# EAGLE design FlightComputer_RevA (EAGLE 9.0.1)
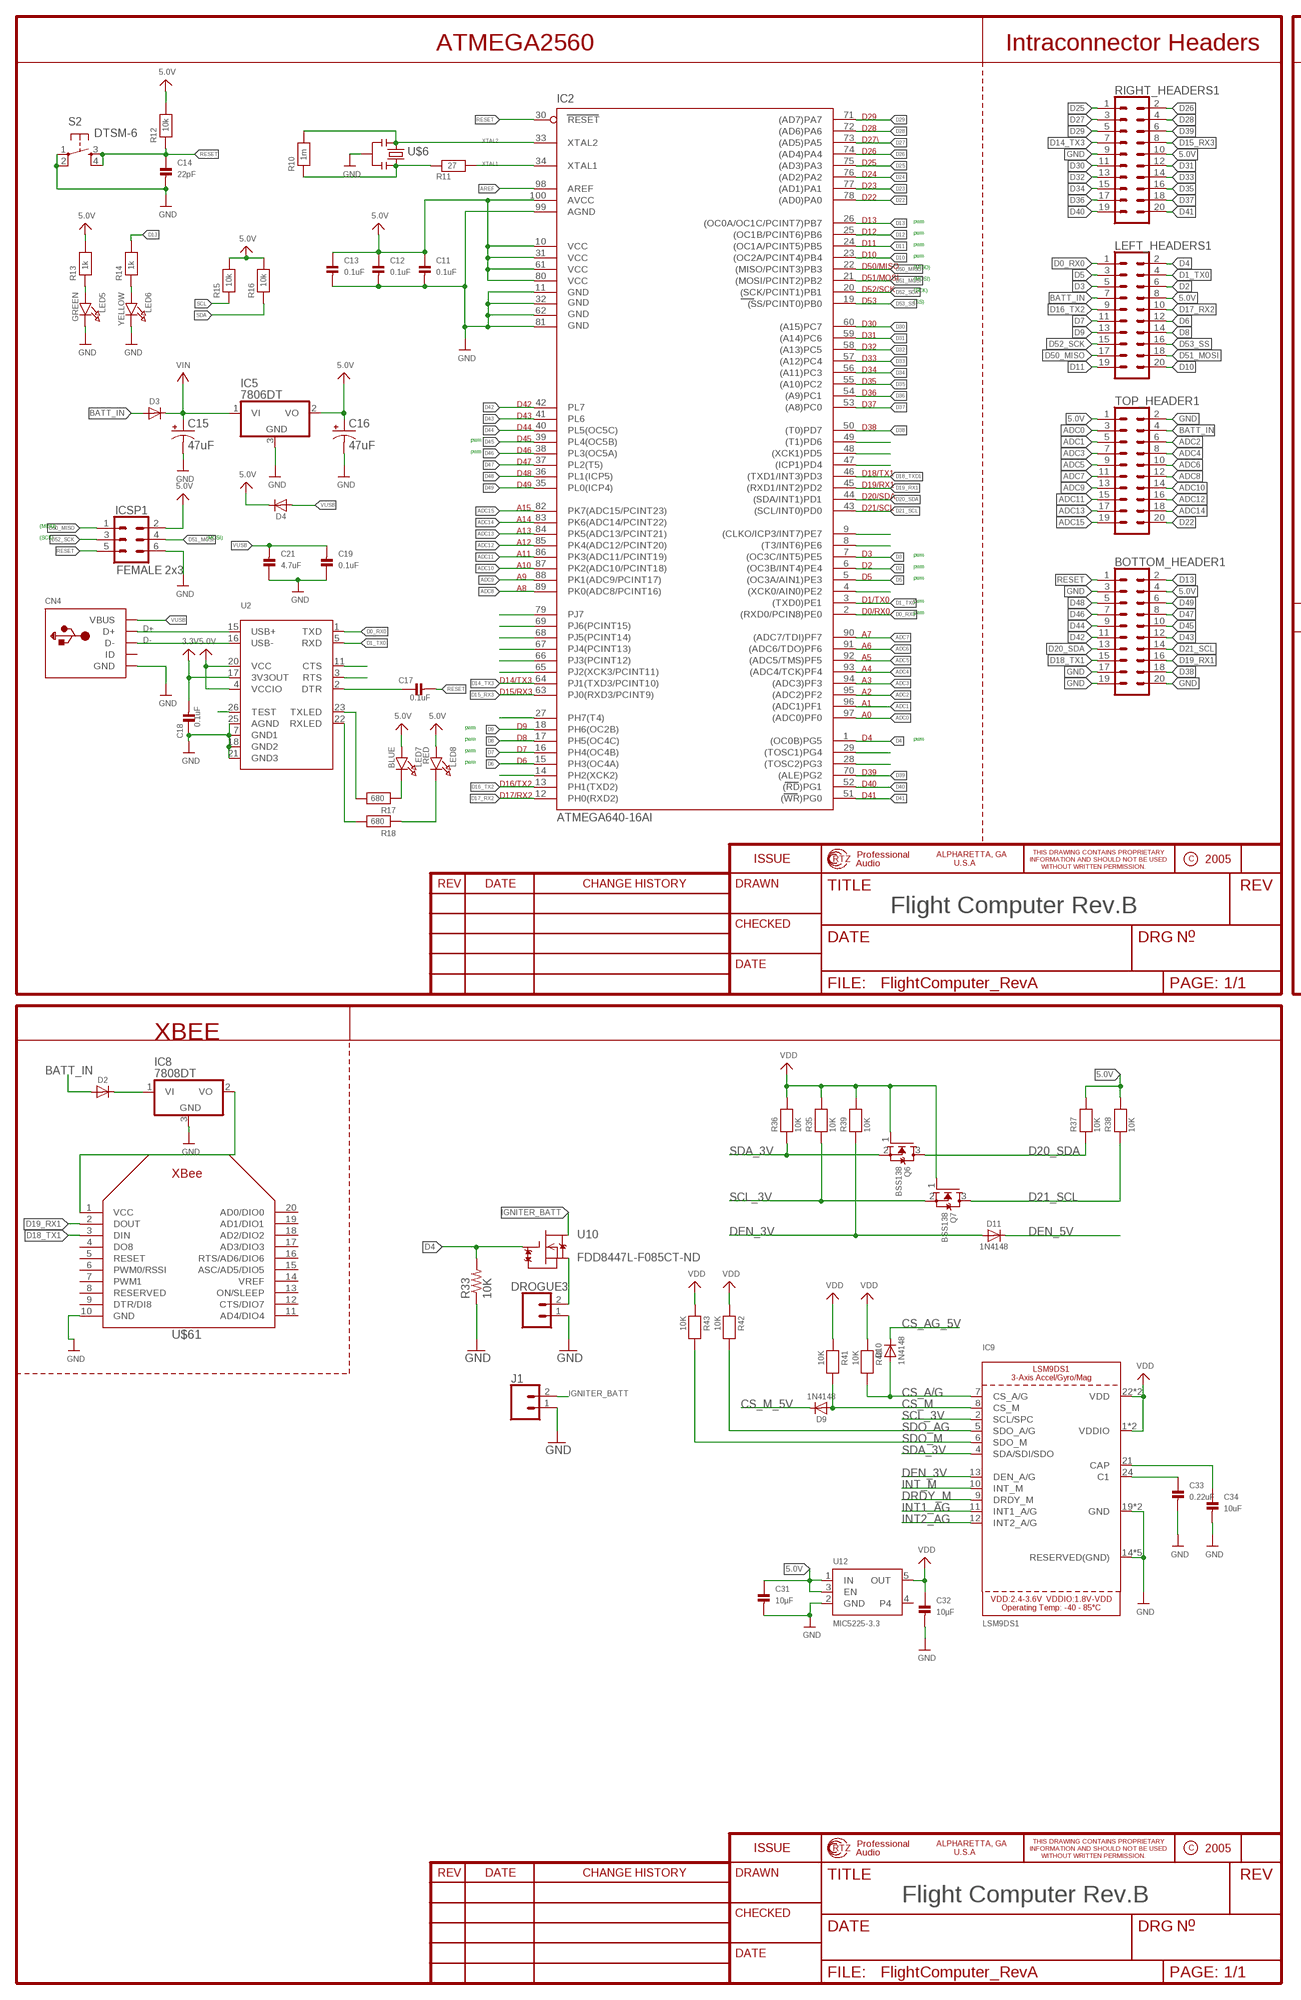
[diagram p0: schematic, sheet 1, part 1 of 2]
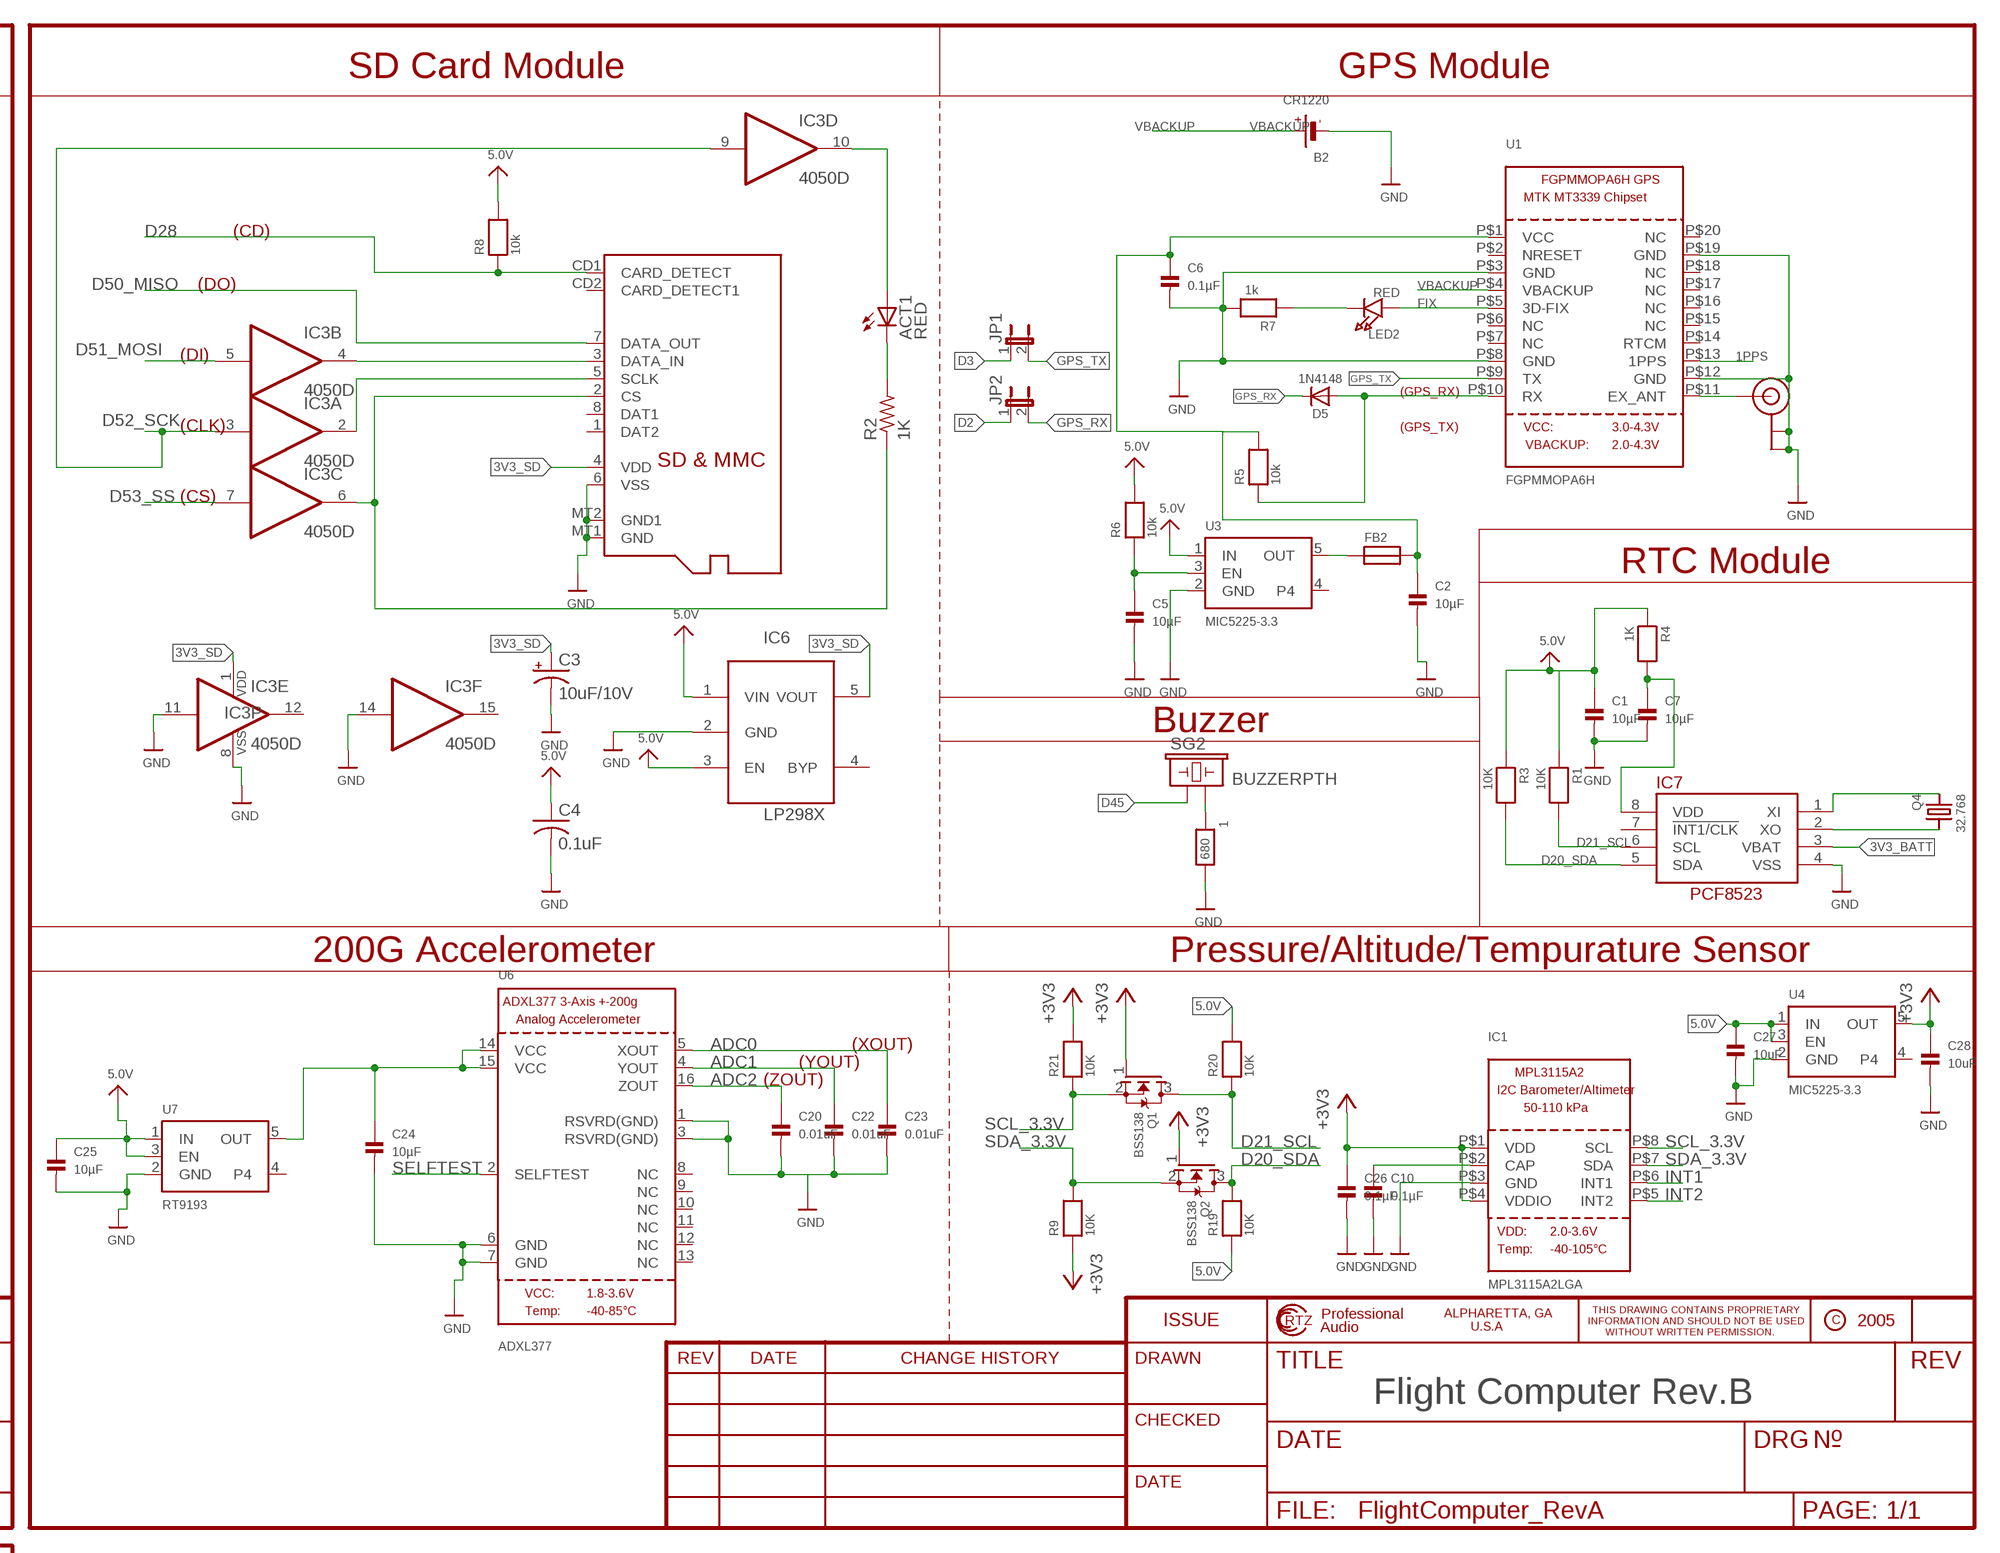
[diagram p1: schematic, sheet 1, part 2 of 2]

## Parts
1  680  RESISTOR0603  [0603]
ACT1  RED  LEDCHIP-LED0805  [CHIP-LED0805]
B2  CR1220  BATTERYCR1220_SMT  [CR1220]
BOTTOM_HEADER1  CONN_10X2  [2X10]
C1  10µF  CAP_CERAMIC0603  [0603]
C2  10µF  CAP_CERAMIC0603  [0603]
C3  10uF/10V  CPOL-USA/3216-18R  [A/3216-18R]
C4  0.1uF  C-USC0805K  [C0805K]
C5  10µF  CAP_CERAMIC0603  [0603]
C6  0.1µF  CAP_CERAMIC0603  [0603]
C7  10µF  CAP_CERAMIC0603  [0603]
C10  0.1µF  CAP_CERAMIC0603  [0603]
C11  0.1uF  CAP_CERAMIC0805  [0805]
C12  0.1uF  CAP_CERAMIC0805  [0805]
C13  0.1uF  CAP_CERAMIC0805  [0805]
C14  22pF  CAP_CERAMIC0805  [0805]
C15  47uF  CPOL-USD  [PANASONIC_D]
C16  47uF  CPOL-USD  [PANASONIC_D]
C17  0.1uF  CAP_CERAMIC0805  [0805]
C18  0.1uF  CAP_CERAMIC0805  [0805]
C19  0.1uF  CAP_CERAMIC0805  [0805]
C20  0.01uF  CAP_CERAMIC0603  [0603]
C21  4.7uF  CAP_CERAMIC0805  [0805]
C22  0.01uF  CAP_CERAMIC0603  [0603]
C23  0.01uF  CAP_CERAMIC0603  [0603]
C24  10µF  CAP_CERAMIC0603  [0603]
C25  10µF  CAP_CERAMIC0603  [0603]
C26  0.1µF  CAP_CERAMIC0603  [0603]
C27  10uF  CAP_CERAMIC0603  [0603]
C28  10uF  CAP_CERAMIC0603  [0603]
C31  10µF  CAP_CERAMIC0603  [0603]
C32  10µF  CAP_CERAMIC0603  [0603]
C33  0.22uF  CAP_CERAMIC0603  [0603]
C34  10uF  CAP_CERAMIC0603  [0603]
CN4  USBMINIB  [USB-MINIB]
D2  DIODESOD-123  [SOD-123]
D3  DIODESOD-123  [SOD-123]
D4  DIODESOD-123  [SOD-123]
D5  1N4148  DIODESOD-323  [SOD-323]
D9  1N4148  DIODESOD-323  [SOD-323]
D10  1N4148  DIODESOD-323  [SOD-323]
D11  1N4148  DIODESOD-323  [SOD-323]
DROGUE3  CONN_023.5MM  [SCREWTERMINAL-3.5MM-2]
FB2  FERRITE  [0603]
IC1  MPL3115A2LGA  [LGA8]
IC2  ATMEGA640-16AI  [TQFP100]
IC3  4050D  [SO16]
IC5  7806DT  [TO252]
IC6  LP298XS  [SOT23-5L]
IC7  RTC_PCF8523T  [SOIC8_150MIL]
IC8  7808DT  [TO252]
IC9  LSM9DS1  [LGA24_3.5X3.1MM]
ICSP1  FEMALE 2x3  CONN_03X2FEMALE  [2X3]
J1  CONN_02  [1X02]
JP1  JUMPER-2SMD-NO-NS  [SJ_2S-NO-NS]
JP2  JUMPER-2SMD-NO-NS  [SJ_2S-NO-NS]
LED2  RED  LED0805  [CHIPLED_0805]
LED5  GREEN  LED0805  [CHIPLED_0805]
LED6  YELLOW  LED0805  [CHIPLED_0805]
LED7  BLUE  LED0805  [CHIPLED_0805]
LED8  RED  LED0805  [CHIPLED_0805]
LEFT_HEADERS1  CONN_10X2  [2X10]
Q1  BSS138  MOSFET-NWIDE  [SOT23-WIDE]
Q2  BSS138  MOSFET-NWIDE  [SOT23-WIDE]
Q4  32.768  CRYSTAL8.0X3.8  [CRYSTAL_8X3.8]
Q6  BSS138  MOSFET-NWIDE  [SOT23-WIDE]
Q7  BSS138  MOSFET-NWIDE  [SOT23-WIDE]
R1  10K  RESISTOR0603  [0603]
R2  1K  R-US_R0805  [R0805]
R3  10K  RESISTOR0603  [0603]
R4  1K  RESISTOR0603  [0603]
R5  10k  RESISTOR0603  [0603]
R6  10k  RESISTOR0603  [0603]
R7  1k  RESISTOR0603  [0603]
R8  10k  RESISTOR0603  [0603]
R9  10K  RESISTOR0603  [0603]
R10  1m  RESISTOR0805  [0805]
R11  27  RESISTOR0805  [0805]
R12  10k  RESISTOR0805  [0805]
R13  1k  RESISTOR0805  [0805]
R14  1k  RESISTOR0805  [0805]
R15  10k  RESISTOR0805  [0805]
R16  10k  RESISTOR0805  [0805]
R17  680  RESISTOR0805  [0805]
R18  680  RESISTOR0805  [0805]
R19  10K  RESISTOR0603  [0603]
R20  10K  RESISTOR0603  [0603]
R21  10K  RESISTOR0603  [0603]
R33  10K  R-US_R0805  [R0805]
R35  10K  RESISTOR0603  [0603]
R36  10K  RESISTOR0603  [0603]
R37  10K  RESISTOR0603  [0603]
R38  10K  RESISTOR0603  [0603]
R39  10K  RESISTOR0603  [0603]
R40  10K  RESISTOR0603  [0603]
R41  10K  RESISTOR0603  [0603]
R42  10K  RESISTOR0603  [0603]
R43  10K  RESISTOR0603  [0603]
RIGHT_HEADERS1  CONN_10X2  [2X10]
S2  DTSM-6  [DTSM-6]
SG2  BUZZERPTH  [BUZZER-12MM]
TOP_HEADER1  CONN_10X2  [2X10]
U1  FGPMMOPA6H  GPS_FGPMMOPA6H  [FGPMMOPA6H]
U2  FT232RLSSOP28  [SSOP28DB]
U3  MIC5225-3.3  VREG_SOT23-5  [SOT23-5]
U4  MIC5225-3.3  VREG_SOT23-5  [SOT23-5]
U6  ADXL377  ACCEL_ADXL377  [LFCSP16_LQ]
U7  RT9193  VREG_SOT23-5  [SOT23-5]
U10  FDD8447L-F085CT-ND  TSM4ND50  [TO252]
U12  MIC5225-3.3  VREG_SOT23-5  [SOT23-5]
U$1  U.FL  [U.FL]
U$6  RESONATORSMD  [RESONATOR-SMD]
U$61  XBEE  [XBEE]
X2  MICROSD  [MICROSD]

## Nets
1PPS: U1.P$13(1PPS)
3.3V [16mil]: C18.2 U2.17(3V3OUT)
3V3_BATT: IC7.3(VBAT)
3V3_SD: C3.+ IC3.1(P:VDD) IC6.5(VOUT) X2.4(VDD)
5.0V: BOTTOM_HEADER1.4 C1.1 C4.1 C11.1 C12.1 C13.1 C16.+ C25.1 C27.1 C31.1 D4.C IC2.10(VCC) IC2.31(VCC1) IC2.61(VCC2) IC2.80(VCC3) IC2.100(AVCC) IC5.2(VO) IC6.1(VIN) IC6.3(EN) ICSP1.2 LED7.A LED8.A LEFT_HEADERS1.8 R1.1 R3.1 R4.1 R6.2 R8.2 R12.2 R13.2 R15.2 R16.2 R19.1 R20.2 R37.2 R38.2 RIGHT_HEADERS1.10 TOP_HEADER1.1 U2.4(VCCIO) U2.20(VCC) U3.1(IN) U4.1(IN) U4.3(EN) U7.1(IN) U7.3(EN) U12.1(IN) U12.3(EN)
+3V3: C26.1 C28.1 IC1.P$1(VDD) IC1.P$4(VDDIO) Q1.1(G) Q2.1(G) R9.1 R21.2 U4.5(OUT)
ADC0: C23.1 IC2.97((ADC0)PF0) TOP_HEADER1.3 U6.5(XOUT)
ADC1: C22.1 IC2.96((ADC1)PF1) TOP_HEADER1.5 U6.4(YOUT)
ADC2: C20.1 IC2.95((ADC2)PF2) TOP_HEADER1.6 U6.16(ZOUT)
ADC3: IC2.94((ADC3)PF3) TOP_HEADER1.7
ADC4: IC2.93((ADC4/TCK)PF4) TOP_HEADER1.8
ADC5: IC2.92((ADC5/TMS)PF5) TOP_HEADER1.9
ADC6: IC2.91((ADC6/TDO)PF6) TOP_HEADER1.10
ADC7: IC2.90((ADC7/TDI)PF7) TOP_HEADER1.11
ADC8: IC2.89(PK0(ADC8/PCINT16)) TOP_HEADER1.12
ADC9: IC2.88(PK1(ADC9/PCINT17)) TOP_HEADER1.13
ADC10: IC2.87(PK2(ADC10/PCINT18)) TOP_HEADER1.14
ADC11: IC2.86(PK3(ADC11/PCINT19)) TOP_HEADER1.15
ADC12: IC2.85(PK4(ADC12/PCINT20)) TOP_HEADER1.16
ADC13: IC2.84(PK5(ADC13/PCINT21)) TOP_HEADER1.17
ADC14: IC2.83(PK6(ADC14/PCINT22)) TOP_HEADER1.18
ADC15: IC2.82(PK7(ADC15/PCINT23)) TOP_HEADER1.19
AREF: IC2.98(AREF)
BATT_IN: D2.A D3.A LEFT_HEADERS1.7 TOP_HEADER1.4
C1: C33.1 IC9.24(C1)
CAP1: C10.1 IC1.P$2(CAP)
CAP3: C34.1 IC9.21(CAP)
CS_A/G: D10.A IC9.7(CS_A/G) R40.2
CS_AG_5V: D10.C
CS_M: D9.A IC9.8(CS_M) R41.2
CS_M_5V: D9.C
D0_RX0: IC2.2((RXD0/PCIN8)PE0) LEFT_HEADERS1.1 U2.1(TXD)
D1_TX0: IC2.3((TXD0)PE1) LEFT_HEADERS1.4 U2.5(RXD)
D2: IC2.6((OC3B/INT4)PE4) JP2.1 LEFT_HEADERS1.6
D3: IC2.7((OC3C/INT5)PE5) JP1.1 LEFT_HEADERS1.5
D4: IC2.1((OC0B)PG5) LEFT_HEADERS1.2 R33.2 U10.G
D5: IC2.5((OC3A/AIN1)PE3) LEFT_HEADERS1.3
D6: IC2.15(PH3(OC4A)) LEFT_HEADERS1.12
D7: IC2.16(PH4(OC4B)) LEFT_HEADERS1.11
D8: IC2.17(PH5(OC4C)) LEFT_HEADERS1.14
D9: IC2.18(PH6(OC2B)) LEFT_HEADERS1.13
D10: IC2.23((OC2A/PCINT4)PB4) LEFT_HEADERS1.20
D11: IC2.24((OC1A/PCINT5)PB5) LEFT_HEADERS1.19
D12: IC2.25((OC1B/PCINT6)PB6)
D13: BOTTOM_HEADER1.2 IC2.26((OC0A/OC1C/PCINT7)PB7) R14.2
D14_TX3: IC2.64(PJ1(TXD3/PCINT10)) RIGHT_HEADERS1.7
D15_RX3: IC2.63(PJ0(RXD3/PCINT9)) RIGHT_HEADERS1.8
D16_TX2: IC2.13(PH1(TXD2)) LEFT_HEADERS1.9
D17_RX2: IC2.12(PH0(RXD2)) LEFT_HEADERS1.10
D18_TX1: BOTTOM_HEADER1.15 U$61.3(DIN)
D18_TXD1: IC2.46((TXD1/INT3)PD3)
D19_RX1: BOTTOM_HEADER1.16 IC2.45((RXD1/INT2)PD2) U$61.2(DOUT)
D20_SDA: BOTTOM_HEADER1.13 IC2.44((SDA/INT1)PD1) IC7.5(SDA) Q2.3(D) Q6.3(D) R3.2 R19.2 R37.1
D21_SCL: BOTTOM_HEADER1.14 IC2.43((SCL/INT0)PD0) IC7.6(SCL) Q1.3(D) Q7.3(D) R1.2 R20.1 R38.1
D22: IC2.78((AD0)PA0) TOP_HEADER1.20
D23: IC2.77((AD1)PA1)
D24: IC2.76((AD2)PA2)
D25: IC2.75((AD3)PA3) RIGHT_HEADERS1.1
D26: IC2.74((AD4)PA4) RIGHT_HEADERS1.2
D27: IC2.73((AD5)PA5) RIGHT_HEADERS1.3
D28: IC2.72((AD6)PA6) R8.1 RIGHT_HEADERS1.4 X2.CD1(CARD_DETECT)
D29: IC2.71((AD7)PA7) RIGHT_HEADERS1.5
D30: IC2.60((A15)PC7) RIGHT_HEADERS1.11
D31: IC2.59((A14)PC6) RIGHT_HEADERS1.12
D32: IC2.58((A13)PC5) RIGHT_HEADERS1.13
D33: IC2.57((A12)PC4) RIGHT_HEADERS1.14
D34: IC2.56((A11)PC3) RIGHT_HEADERS1.15
D35: IC2.55((A10)PC2) RIGHT_HEADERS1.16
D36: IC2.54((A9)PC1) RIGHT_HEADERS1.17
D37: IC2.53((A8)PC0) RIGHT_HEADERS1.18
D38: BOTTOM_HEADER1.18 IC2.50((T0)PD7)
D39: IC2.70((ALE)PG2) RIGHT_HEADERS1.6
D40: IC2.52((RD)PG1) RIGHT_HEADERS1.19
D41: IC2.51((WR)PG0) RIGHT_HEADERS1.20
D42: BOTTOM_HEADER1.11 IC2.42(PL7)
D43: BOTTOM_HEADER1.12 IC2.41(PL6)
D44: BOTTOM_HEADER1.9 IC2.40(PL5(OC5C))
D45: BOTTOM_HEADER1.10 IC2.39(PL4(OC5B)) SG2.+
D46: BOTTOM_HEADER1.7 IC2.38(PL3(OC5A))
D47: BOTTOM_HEADER1.8 IC2.37(PL2(T5))
D48: BOTTOM_HEADER1.5 IC2.36(PL1(ICP5))
D49: BOTTOM_HEADER1.6 IC2.35(PL0(ICP4))
D50_MISO: IC2.22((MISO/PCINT3)PB3) ICSP1.1 LEFT_HEADERS1.17 X2.7(DATA_OUT)
D51_MOSI: IC2.21((MOSI/PCINT2)PB2) IC3.5(B:I) ICSP1.4 LEFT_HEADERS1.18
D52_SCK: IC2.20((SCK/PCINT1)PB1) IC3.3(A:I) IC3.9(D:I) ICSP1.3 LEFT_HEADERS1.15
D53_SS: IC2.19((SS/PCINT0)PB0) IC3.7(C:I) LEFT_HEADERS1.16
D+: CN4.D+ U2.15(USB+)
D-: CN4.D- U2.16(USB-)
DEN_3V: D11.A IC9.13(DEN_A/G) R39.1
DEN_5V: D11.C
DRDY_M: IC9.9(DRDY_M)
FIX: LED2.A U1.P$5(3D-FIX)
GND: 1.2 B2.- BOTTOM_HEADER1.3 BOTTOM_HEADER1.17 BOTTOM_HEADER1.19 BOTTOM_HEADER1.20 C1.2 C2.2 C3.- C4.2 C5.2 C6.2 C7.2 C10.2 C11.2 C12.2 C13.2 C14.2 C15.- C16.- C18.1 C19.1 C20.2 C21.1 C22.2 C23.2 C24.2 C25.2 C26.2 C27.2 C28.2 C31.2 C32.2 C33.2 C34.2 CN4.GND DROGUE3.1 IC1.P$3(GND) IC2.11(GND) IC2.32(GND1) IC2.62(GND2) IC2.81(GND3) IC2.99(AGND) IC3.8(P:VSS) IC3.11(E:I) IC3.14(F:I) IC5.3(GND) IC6.2(GND) IC7.4(VSS) IC8.3(GND) IC9.14(RESERVED(GND)) IC9.15(RESERVED(GND)) IC9.16(RESERVED(GND)) IC9.17(RESERVED(GND)) IC9.18(RESERVED(GND)) IC9.19(GND) IC9.20(GND) ICSP1.6 J1.1 LED5.C LED6.C R7.2 R33.1 RIGHT_HEADERS1.9 S2.1 S2.2 TOP_HEADER1.2 U1.P$3(GND) U1.P$8(GND) U1.P$12(GND) U1.P$19(GND) U2.7(GND1) U2.18(GND2) U2.21(GND3) U2.25(AGND) U3.2(GND) U4.2(GND) U6.1(RSVRD(GND)) U6.3(RSVRD(GND)) U6.6(GND) U6.7(GND) U7.2(GND) U12.2(GND) U$1.P$1(GND) U$1.P$2(GND) U$6.2 U$61.10(GND) X2.6(VSS) X2.MT1(GND) X2.MT2(GND1)
GPS_RX: D5.C JP2.2
GPS_TX: JP1.2 U1.P$9(TX)
IGNITER_BATT: J1.2 U10.D
INT1: IC1.P$6(INT1)
INT1_AG: IC9.11(INT1_A/G)
INT2: IC1.P$5(INT2)
INT2_AG: IC9.12(INT2_A/G)
INT_M: IC9.10(INT_M)
N$2: IC7.1(XI) Q4.P$1
N$3: IC7.2(XO) Q4.P$4
N$6: ACT1.A IC3.10(D:O)
N$7: IC3.2(A:O) X2.5(SCLK)
N$8: IC3.6(C:O) R2.1 X2.2(CS)
N$9: ACT1.C R2.2
N$10: IC3.4(B:O) X2.3(DATA_IN)
N$11: C7.1 IC7.8(VDD) R4.2
N$12: U1.P$11(EX_ANT) U$1.P$3(SIGNAL)
N$13: D5.A R5.1 U1.P$10(RX)
N$14: C2.1 C6.1 FB2.2 R5.2 U1.P$1(VCC)
N$15: R10.1 R11.2 U$6.3
N$16: IC2.65(PJ2(XCK3/PCINT11))
N$17: IC2.66(PJ3(PCINT12))
N$18: C5.1 R6.1 U3.3(EN)
N$19: LED2.C R7.1
N$22: D2.C IC8.1(VI)
N$23: 1.1 SG2.-
N$27: IC2.67(PJ4(PCINT13))
N$32: IC2.68(PJ5(PCINT14))
N$33: IC2.69(PJ6(PCINT15))
N$34: IC2.79(PJ7)
N$35: IC2.27(PH7(T4))
N$36: C24.1 IC2.14(PH2(XCK2)) U6.14(VCC) U6.15(VCC) U7.5(OUT)
N$37: IC2.49((T1)PD6)
N$38: IC2.48((XCK1)PD5)
N$39: IC2.47((ICP1)PD4)
N$40: IC2.9((CLKO/ICP3/INT7)PE7)
N$41: IC2.8((T3/INT6)PE6)
N$42: IC2.4((XCK0/AIN0)PE2)
N$43: IC2.29((TOSC1)PG4)
N$44: IC2.28((TOSC2)PG3)
N$45: LED5.A R13.1
N$46: LED6.A R14.1
N$47: LED8.C R18.1
N$48: LED7.C R17.1
N$49: U2.11(CTS)
N$50: U2.3(RTS)
N$51: C17.1 U2.2(DTR)
N$52: R18.2 U2.22(RXLED)
N$53: R17.2 U2.23(TXLED)
N$54: U2.26(TEST)
OUT: FB2.1 U3.5(OUT)
RESET: BOTTOM_HEADER1.1 C14.1 C17.2 IC2.30(RESET) ICSP1.5 R12.1 S2.3 S2.4
SCL: R15.1
SCL_3.3V: IC1.P$8(SCL) Q1.2(S) R21.1
SCL_3V: IC9.2(SCL/SPC) Q7.2(S) R35.1
SDA: R16.1
SDA_3.3V: IC1.P$7(SDA) Q2.2(S) R9.2
SDA_3V: IC9.4(SDA/SDI/SDO) Q6.2(S) R36.1
SDO_AG: IC9.5(SDO_A/G) R42.2
SDO_M: IC9.6(SDO_M) R43.2
SELFTEST: U6.2(SELFTEST)
SOURCE2: DROGUE3.2 U10.S
VBACKUP: B2.+$1(+) B2.+$2(+) U1.P$4(VBACKUP)
VCC: IC8.2(VO) U$61.1(VCC)
VDD: C32.1 IC9.1(VDDIO) IC9.3(VDDIO) IC9.22(VDD) IC9.23(VDD) Q6.1(G) Q7.1(G) R35.2 R36.2 R39.2 R40.1 R41.1 R42.1 R43.1 U12.5(OUT)
VIN [24mil]: C15.+ D3.C IC5.1(VI)
VUSB [16mil]: C19.2 C21.2 CN4.VBUS D4.A
XTAL1: IC2.34(XTAL1) R11.1
XTAL2: IC2.33(XTAL2) R10.2 U$6.1
Unconnected: CN4.ID IC3.12(E:O) IC3.15(F:O) IC6.4(BYP) IC7.7(!INT1/CLK) U1.P$2(NRESET) U1.P$6(NC) U1.P$7(NC) U1.P$14(RTCM) U1.P$15(NC) U1.P$16(NC) U1.P$17(NC) U1.P$18(NC) U1.P$20(NC) U3.4 U4.4 U6.8(NC) U6.9(NC) U6.10(NC) U6.11(NC) U6.12(NC) U6.13(NC) U7.4 U12.4 U$61.4(DO8) U$61.5(RESET) U$61.6(PWM0/RSSI) U$61.7(PWM1) U$61.8(RESERVED) U$61.9(DTR/DI8) U$61.11(AD4/DIO4) U$61.12(CTS/DIO7) U$61.13(ON/SLEEP) U$61.14(VREF) U$61.15(ASC/AD5/DIO5) U$61.16(RTS/AD6/DIO6) U$61.17(AD3/DIO3) U$61.18(AD2/DIO2) U$61.19(AD1/DIO1) U$61.20(AD0/DIO0) X2.1(DAT2) X2.8(DAT1) X2.CD2(CARD_DETECT1)

## Notes on the sheet
- ATMEGA2560 | Intraconnector Headers | SD Card Module | GPS Module
- D29
- D28
- D27\
- D26 | (CD)
- D25
- D24
- D23 | (DO)
- D22
- D13 | pwm
- D12 | pwm | (DI)
- D11 | pwm
- D10 | pwm | (GPS_RX)
- D50/MISO | (MISO)
- D51/MOSI | (MOSI) | (CLK) | (GPS_TX)
- D52/SCK | (SCK)
- D53 | (SS)
- D30 | (CS)
- D31
- D32
- D33
- D34 | RTC Module
- D35
- D36
- D42 | D37
- D43
- D44 | D38
- pwm | D45
- pwm | D46
- D47
- D48 | D18/TX1 | Buzzer
- D49 | D19/RX1
- D20/SDA
- A15 | D21/SCL
- A14
- (MISO)
- A13
- (SCK) | (MOSI)
- A12
- A11 | D3 | pwm
- A10 | D2 | pwm
- A9 | D5 | pwm
- A8
- D1/TX0 | pwm
- D0/RX0 | pwm
- 200G Accelerometer | Pressure/Altitude/Tempurature Sensor
- A7
- A6
- A5
- A4
- D14/TX3 | A3 | (XOUT)
- D15/RX3 | A2 | (YOUT)
- A1 | (ZOUT)
- A0
- pwm | D9
- pwm | D8 | D4 | pwm
- pwm | D7
- pwm | D6
- D39
- D16/TX2 | D40
- D17/RX2 | D41
- Flight Computer Rev.B | Flight Computer Rev.B
- XBEE
- Flight Computer Rev.B

## Library data of the parts
1 R1 R3-R21 R35-R43 = microbuilder:RESISTOR: Resistors 0402 - 0402 Surface Mount Package 22 Ohm 1% 1/16W [Digikey: 311-22.0LRTR-ND] 33 Ohm 5% 1/16W 1.0K 5% 1/16W 1.5K 5% 1/16W 2.0K 1% 1/16W 10.0K 1% 1/16W [Digikey: 311-10.0KLRTR-ND] 10.0K 5% 1/16W [Digikey: RMCF0402JT10K0TR-ND] 12.1K 1% 1/16W [Digikey: 311-22.0LRTR-ND] 100.0K 5% 1/16W 0603 - 0603 Surface Mount Package 0 Ohm 1/10 Watt 1% Resistor 15 Ohm 1/10 Watt 1% Resistor 33 Ohm 1/10 Watt 1% Resistor 49.9 Ohm 1/10 Watt 1% Resistor 100 Ohm 1/10 Watt 1% Resistor 150 Ohm 1/10 Watt 1% Resistor 240 Ohm 1/10 Watt 1% Resistor 390 Ohm 1/10 Watt 1% Resistor 560 Ohm 1/10 Watt 1% Resistor 680 Ohm 1/10 Watt 1% Resistor 750 Ohm 1/10 Watt 1% Resistor 1.0K Ohm 1/10 Watt 1% Resistor 1.5K Ohm 1/10 Watt 1% Resistor 2.0K Ohm 1/10 Watt 1% Resistor 2.2K Ohm 1/10 Watt 1% Resistor 3.3K Ohm 1/10 Watt 1% Resistor 4.7K Ohm 1/10 Watt 1% Resistor 10.0K Ohm 1/10 Watt 1% Resistor 12.0K Ohm 1/10 Watt 1% Resistor 12.1K Ohm 1/10 Watt 1% Resistor 20.0K Ohm 1/10 Watt 1% Resistor 33.0K Ohm 1/10 Watt 1% Resistor 100.0K Ohm 1/10 Watt 1% Resistor 0805 - 0805 Surface Mount Package 0 Ohm 1/8 Watt 1% Resistor 33 Ohm 1/8 Watt 1% Resistor 100 Ohm 1/8 Watt 1% Resistor 150 Ohm 1/8 Watt 1% Resistor 200 Ohm 1/8 Watt 1% Resistor 240 Ohm 1/8 Watt 1% Resistor 330 Ohm 1/8 Watt 1% Resistor 390 Ohm 1/8 Watt 1% Resistor 470 Ohm 1/8 Watt 1% Resistor 1.0K Ohm 1/8 Watt 1% Resistor 1.5K Ohm 1/8 Watt 1% Resistor 2.0K Ohm 1/8 Watt 1% Resistor 4.7K Ohm 1/8 Watt 1% Resistor 5.1K Ohm 1/8 Watt 1% Resistor 5.6K Ohm 1/8 Watt 1% Resistor 10.0K Ohm 1/8 Watt 1% Resistor 22.0K Ohm 1/8 Watt 1% Resistor 33.0K Ohm 1/8 Watt 1% Resistor 100K Ohm 1/8 Watt 1% Resistor 1206 - 1206 Surface Mount Package 2012 - 2010 Surface Mount Package 0.11 Ohm 1/2 Watt 1% Resistor - Digikey: RHM.11UCT-ND
ACT1 = adafruit:LED: LED
B2 = microbuilder:BATTERY: CR1220 SMT - Digikey: 3001K-ND CD2032 BAT-HLD-001 - Digikey: BAT-HLD-001-ND
BOTTOM_HEADER1 LEFT_HEADERS1 RIGHT_HEADERS1 TOP_HEADER1 = SparkFun-Connectors:CONN_10X2: Multi connection point. Often used as Generic Header-pin footprint for 0.1 inch spaced/style header connections On any of the 0.1 inch spaced packages, you can populate with these: Break Away Headers - Straight <https://www.sparkfun.com/products/116> (PRT-00116) Break Away Male Headers - Right Angle <https://www.sparkfun.com/products/553> (PRT-00553) Female Headers <https://www.sparkfun.com/products/115> (PRT-00115) Break Away Headers - Machine Pin <https://www.sparkfun.com/products/117> (PRT-00117) Break Away Female Headers - Swiss Machine Pin <https://www.sparkfun.com/products/743> (PRT-00743) Special note about the "SPECIAL" package: This was SPECIALLY designed to be used with our Graphic LCD Backpack. Be sure you want to use this! It is not only staggered on each line of header holes, but IT IS ALSO offset of the center point of the top and bottom lines by 5 mil. This causes the headers to lock into place on the "standard" footprint on the LCD screen. The extra squares on the tdocu layer are there simply to reference other pins (if you were to actually populate a longer header than ten long - this is what we do with the backpacks).
C1 C2 C5-C7 C10-C14 C17-C28 C31-C34 = microbuilder:CAP_CERAMIC: Ceramic Capacitors 0402 - 0402 Surface Mount Capacitors 16pF 50V 5% [Digikey: 445-4899-2-ND] 18pF 50V 5% [Digikey: 490-1281-2-ND] 22pF 50V 5% [Digikey: 490-1283-2-ND] 68pF 50V 5% [Digikey: 490-1289-2-ND] 0.1uF 10V 10% [Digikey: 490-1318-2-ND] 1.0uF 6.3V 10% [Digikey: 490-1320-2-ND] 0603 - 0603 Surface Mount Capacitors 16 pF 50V 5% [Digikey: 445-5051-2-ND] 22 pF 50V [Digikey: PCC220ACVTR-ND] 33 pF 50V 5% [Digikey: 490-1415-1-ND] 56pF 50V 5% [Digikey: 490-1421-1-ND] 220pF 50V 5% [Digikey: 445-1285-1-ND] 680 pF 50V 2200 pF 50V 5% C0G [Digikey: 445-1297-1-ND] 5600 pF 100V 5% X7R [Digikey: 478-3711-1-ND] 0.1 µF 25V 10% [Digikey: PCC2277TR-ND] 0.22 µF 16V 10% X7R [Digikey: 445-1318-1-ND] 1.0 µF 25V 10% [Digikey: 445-5146-2-ND] 0603 - RF Specific 3pF 250V +/-0.1pF RF [Digikey: 712-1347-1-ND] 18 pF 250V 5% [Digikey: 478-3505-1-ND or 712-1322-1-ND] 56 pF 250V 5% C0G RF [Digikey: 490-4867-1-ND] 68 pF 250V RF [Digikey: 490-4868-1-ND] 0805 - 0805 Surface Mount Capacitors 220 pF 250V 2% RF Ceramic Capacitor [Digikey: 712-1398-1-ND] 1000 pF 50V 2% NP0 Ceramic Capacitor [Digikey: 478-3760-1-ND] 0.1 µF 25V 10% Ceramic Capacitor [Digikey: PCC1828TR-ND] 1.0 µF 16V 10% Ceramic Capacitor[Digikey: 490-1691-2-ND] 10.0 µF 10V 10% Ceramic Capacitor[Digikey: 709-1228-1-ND] 10.0 uF 16V 10% Ceramic Capacitor [Digikey: 478-5165-2-ND] 47 uF 6.3V 20% Ceramic Capacitor [Digikey: 587-1779-1-ND or 399-5506-1-ND] 1206 - 1206 Surface Mount Capacitors 47uF 10V 20% Ceramic Capacitor [Digikey: 490-5528-1-ND or 399-5508-1-ND or 445-6010-1-ND]
C3 = adafruit:CPOL-US: POLARIZED CAPACITOR, American symbol
C4 = adafruit:C-US: CAPACITOR, American symbol
C15 C16 = rcl:CPOL-US: POLARIZED CAPACITOR, American symbol; SPICEPREFIX: C
CN4 = adafruit:USB: USB Connectors USBMINIB - Surface Mount Female Mini-B USB Connector 4UConnector: 06564 By microbuilder.eu Thru-hole RA Female Mini-B USB Connector 4UConnector: 18732 By ladyada.net
D2-D5 D9-D11 = microbuilder:DIODE: Diode SMA Model Volts Amps Type Vf Ir Digikey # Notes SSA34-E3 40V 3A Schottky 480mV @ 3A 200uA @ 40V SSA34-E3/61TGITR-ND CDBA120-G 20V 1A Schottky 500mV @ 1A 500uA @ 20V 641-1014-6-ND REEL MBRA210 10V 2A Schottky 350mV @ 2A 700uA @ 10V MBRA210LT3 SOD-123 Model Volts Amps Type Vf Ir Order # Notes BAT54T1G 30V 200mA Schottky 800mV @ 200mA 2uA @ 25V BAT54T1GOSTR-ND B0530W 30V 500mA Schottky 430mV @ 500mA 130uA @ 30V B0530W-FDICT-ND REEL MBR120 20V 1A Schottky 340mV @ 1A MBR120VLSFT1GOSCT-ND SOD-323 Model Volts Amps Type Vf Ir Order # Notes PMEG2005EJ 20V 500mA Schottky 355mV @ 500mA 568-4110-1-ND ZLLS410 10V 570mA Schottky 380mV @ 570mA ZLLS410CT-ND 1N4148WS 75V 150mA Silicon/Simple 1V 1N4148WSFSCT-ND REEL SOD-523 Model Volts Amps Type Vf Ir Order # Notes BAT54XV2 30V 200mA Schottky 0.8V @ 100mA BAT54XV2CT-ND TB751S 30V 30mA Schottky RB751S-40TE61CT-ND SOT23-R/W (R = Solder Paste/Reflow Ovens, W = Hand-Soldering) Model Volts Amps Type Vf Ir Order # Notes BAT54FILM 40V 300mA Schottky 497-7162-1-ND POWERDI-5 Model Volts Amps Type Vf Ir Order # Notes PDS560 60V 5A Schottky 670mV @ 5A 150uA @ 60V PDS560DICT-ND
DROGUE3 = SparkFun-Connectors:CONN_02: Multi connection point. Often used as Generic Header-pin footprint for 0.1 inch spaced/style header connections On any of the 0.1 inch spaced packages, you can populate with these: Break Away Headers - Straight <https://www.sparkfun.com/products/116> (PRT-00116) Break Away Male Headers - Right Angle <https://www.sparkfun.com/products/553> (PRT-00553) Female Headers <https://www.sparkfun.com/products/115> (PRT-00115) Break Away Headers - Machine Pin <https://www.sparkfun.com/products/117> (PRT-00117) Break Away Female Headers - Swiss Machine Pin <https://www.sparkfun.com/products/743> (PRT-00743) For SCREWTERMINALS and SPRING TERMINALS visit here: Screw Terimnals on SparkFun.com <https://www.sparkfun.com/search/results?term=Screw+Terminals> (5mm/3.5mm/2.54mm spacing) This device is also useful as a general connection point to wire up your design to another part of your project. Our various solder wires solder well into these plated through hole pads. Hook-Up Wire - Assortment (Stranded, 22 AWG) <https://www.sparkfun.com/products/11375> (PRT-11375) Hook-Up Wire - Assortment (Solid Core, 22 AWG) <https://www.sparkfun.com/products/11367> (PRT-11367) View the entire wire category on our website here <https://www.sparkfun.com/categories/141> Special notes: Molex polarized connector foot print use with: PRT-08233 with associated crimp pins and housings. 2.54_SCREWTERM for use with PRT-10571. 3.5mm Screw Terminal footprints for PRT-08084 5mm Screw Terminal footprints for use with PRT-08432; PROD_ID: CONN-08399
FB2 = microbuilder:FERRITE: Ferrite Bead 0603 MMZ1608B121C - 120 Ohm, 600mA Ferrite Chip - Digikey: 445-2164-1-ND BK1608HW121-T - 120 Ohm, 600mA Ferrite Chip - Digikey: 587-1876-2-ND
IC1 = microbuilder:MPL3115A2
IC2 = atmel-2005:ATMEGA*: MICROCONTROLLER 64/128/256 Kbytes FLASH 4 Kbytes EEPROM 8 Kbytes SRAM 86 General Purpose I/O pins 12-channels16-bit PWM 4 x Serial USARTs 16-channels 10-bit A/D
IC3 = 40xx:4050: Hex non-inverting BUFFER
IC5 IC8 = adafruit:78*: Positive VOLTAGE REGULATOR Added bigger pads to the TO-92 package
IC6 = adafruit:LP298X
IC7 = microbuilder:RTC_PCF8523
IC9 = microbuilder:LSM9DS1
ICSP1 = SparkFun-Connectors:CONN_03X2: Multi connection point. Often used as Generic Header-pin footprint for 0.1 inch spaced/style header connections You can populate with any combo of single row headers, but if you'd like an exact match, check these: Header - 2x3 (Male, 0.1") <https://www.sparkfun.com/products/12807> (PRT-12807) Header - 2x3 (Female, 0.1") <https://www.sparkfun.com/products/13010> (PRT-13010) 2x3 Pin Shrouded Header <https://www.sparkfun.com/products/10877> (PRT-10877) On any of the 0.1 inch spaced packages, you can populate with these: Break Away Headers - Straight <https://www.sparkfun.com/products/116> (PRT-00116) Break Away Male Headers - Right Angle <https://www.sparkfun.com/products/553> (PRT-00553) Female Headers <https://www.sparkfun.com/products/115> (PRT-00115) Break Away Headers - Machine Pin <https://www.sparkfun.com/products/117> (PRT-00117) Break Away Female Headers - Swiss Machine Pin <https://www.sparkfun.com/products/743> (PRT-00743) Special note: the shrouded connector mates well with our 3x2 ribbon cables: Ribbon Crimp Connector - 6-pin (2x3, Female) <https://www.sparkfun.com/products/10651> (PRT-10651) Ribbon Cable - 6 wire (15ft) <https://www.sparkfun.com/products/10646> (PRT-10646); PROD_ID: CONN-11566
J1 = SparkFun-Connectors:CONN_02: Multi connection point. Often used as Generic Header-pin footprint for 0.1 inch spaced/style header connections On any of the 0.1 inch spaced packages, you can populate with these: Break Away Headers - Straight <https://www.sparkfun.com/products/116> (PRT-00116) Break Away Male Headers - Right Angle <https://www.sparkfun.com/products/553> (PRT-00553) Female Headers <https://www.sparkfun.com/products/115> (PRT-00115) Break Away Headers - Machine Pin <https://www.sparkfun.com/products/117> (PRT-00117) Break Away Female Headers - Swiss Machine Pin <https://www.sparkfun.com/products/743> (PRT-00743) For SCREWTERMINALS and SPRING TERMINALS visit here: Screw Terimnals on SparkFun.com <https://www.sparkfun.com/search/results?term=Screw+Terminals> (5mm/3.5mm/2.54mm spacing) This device is also useful as a general connection point to wire up your design to another part of your project. Our various solder wires solder well into these plated through hole pads. Hook-Up Wire - Assortment (Stranded, 22 AWG) <https://www.sparkfun.com/products/11375> (PRT-11375) Hook-Up Wire - Assortment (Solid Core, 22 AWG) <https://www.sparkfun.com/products/11367> (PRT-11367) View the entire wire category on our website here <https://www.sparkfun.com/categories/141> Special notes: Molex polarized connector foot print use with: PRT-08233 with associated crimp pins and housings. 2.54_SCREWTERM for use with PRT-10571. 3.5mm Screw Terminal footprints for PRT-08084 5mm Screw Terminal footprints for use with PRT-08432
JP1 JP2 = SparkFun-Retired:JUMPER-2: Jumper Basic 0.1" spaced jumper. Use with breakaway headers.
LED2 LED5-LED8 = microbuilder:LED: LED
Q1 Q2 Q6 Q7 = microbuilder:MOSFET-N: N-Channel Mosfet LEGEND VDS: Voltage Drain-Source ID: Drain Current RDS(ON): Drain-Source On-State Resistance VGS(TH): Gate-Source Threshold Voltage CISS: Drain-Source Input Capacitance SOT-23 Name VDS ID RDS(ON) VGS(TH) CISS Order Number 2N7002E 60V 260mA 2.5 Ohm 2.5V @ 250uA 26.7pF @ 25V 2N7002ET1GOSTR-ND BSH103 30V 850mA 400 mOhm 400mV @ 1mA 83pF @ 24V BSH103,235-ND BSS138 60V 320mA 1.6 Ohm 1.5V @ 250uA 50pF @ 10V Mouser: 771-BSS138PW115 DMN2075U-7 20V 4.2A 38 mOhm 1V @ 250 uA 594.3pF @ 10V DMN2075U-7DICT-ND * BSS138 good choice for I2C level-shifting POWERPAK 1212-8 Name VDS ID RDS(ON) VGS(TH) CISS Order Number Si7308DN 60V 6A 58 mOhm 3V @ 250uA 665pF @ 15V SI7308DN-T1-E3CT-ND
Q4 = microbuilder:CRYSTAL: Crystals HC49UP - Surface Mount Crystal 4.0MHz 18pF +/-30ppm Surface Mount Crystal [Digikey: 535-9857-1-ND] 12.0 MHz Surface Mount Crystal [Digikey: 535-9869-6-ND] 25.0 MHz Surface Mount Crystal [Digikey: 535-9078-1-ND] 2.5 x 2.0mm - MEMs SMT Crystal 16.0 MHz 10pF 20ppm 2.5 x 2.0mm Crystal [Digikey -40-85°C: 535-10923-1-ND] 3.2 x 2.5mm - MEMs SMT Crystal 12.0 MHz 8pF 15ppm 3.2 x 2.5mm Crystal [Digikey: -10-70°C: 644-1047-1-ND -40-125°C: 644-1128-1-ND] 40~85°C cheaper: 644-1173-6-ND 16.0 MHz 8pF 15ppm 3.2 x 2.5mm Crystal [Digikey: -10-70°C: 644-1049-1-ND -40-125°C: 644-1129-2-ND]-40~85°C cheaper: 644-1175-6-ND 16.0 MHz 10pF 10ppm 3.2 x 2.5mm Crystal [Digikey: 644-1100-1-ND] 27.12 MHz 18pF 30ppm 3.2 x 2.5mm Crystal [Digikey: 887-1424-1-ND] 27.12MHz 10pF 10ppm 3.2 x 2.5mm Crystal [Digikey: 887-1329-1-ND] 4.9 x 1.8mm - MEMs SMT Crystal 32.768 KHz 12.5pF 20ppm 4.9 x 1.8mm Crystal [Digikey: SE2415CT-ND] 8.0 x 3.8mm - Surface Mount Crystal 32.768kHz 12.5pF 20ppm -40°C-85°C [Digikey: 535-9166-2-ND] Cylinder 32.768KHz Cylinder Crystal (2x6mm body) [Ex. Digikey: 300-8341-2-ND]
R2 R33 = adafruit:R-US_: RESISTOR, American symbol
S2 = switch-tact:DTSM-6
SG2 = SparkFun:BUZZER: Buzzer 12mm Spark Fun Electronics SKU : Comp-Buzzer
U1 = microbuilder:GPS_FGPMMOPA6H: GPS Module - MTK MT3339 Chipset, -165dBm sensitivity, 22 channels, 10Hz, auto-select external antenna options
U2 = microbuilder:FT232RL: FTDI FT232RL USB TO RS232 Converter Digikey: 768-1007-1-ND
U3 U4 U7 U12 = microbuilder:VREG_SOT23-5: SOT23-5 Fixed Voltage Regulators Part Current Out V Out V In V Dropout θJA (°C/W) TJ (°C) Digikey Part No. ADP121 150mA 3.3V 3.4-5.5V 0.09V @ 150mA -- -- ADP121-AUJZ33R7CT-ND ADP121 150mA 3.0V 3.1-5.5V 0.09V @ 150mA -- -- ADP121-AUJZ30R7CT-ND ADP122 300mA 3.3V 3.4-5.5V 0.085V @ 300mA -- -- ADP122AUJZ-3.3-R7CT-ND ADP1712 300mA 3.3V 3.5-5.5V 0.17V @ 300mA -- -- ADP1712AUJZ-3.3-R7TR-ND AP7311 (Low Cost) 150mA 3.3V 3.5-6V 0.15V @ 150mA -- -- AP7311-33WG-7DICT-ND LD39015M18R 150mA 1.8V 1.9V-5.5V 0.08V @ 100mA -- -- 497-6977-1-ND LP2985A-33DBVR 150mA 3.3V 3.3-16V 0.28V @ 150mA 206 150 296-18479-1-ND MCP1824T-3302E/OT 300mA 3.3V 3.5V-6V 0.2V @ 300mA -- -- MCP1824T-3302E/OTCT-ND MIC5205-2.5YM5 TR 150mA 2.5V 2.7-16V 0.165V @ 150mA -- -- 576-1257-2-ND MIC5205-3.0YM5 TR 150mA 3.0V 3.2V-16V 0.165V @ 150mA -- -- 576-1258-2-ND MIC5205-3.3YM5 TR 150mA 3.3V 3.5V-16V 0.165V @ 150mA -- -- 576-1259-2-ND TPS780330220 150mA 3.3V+2.2V 3.6-5.5V 250mV Max -- -- 296-23332-1-ND TDA3663/N1,135 100mA 3.3V 3.5-45V 0.18V @ 50mA -- -- 568-5343-1-ND Max operating temp can be calculated using θJA, TJ (max junction temperature), and power in watts. Set the "Maximum Ambient Temperature" until it reaches TJ ("Max Junction Temperature"), which is the absolute limit for safe use of the regulator: Heat Sink Temperature Calculator <http://www.daycounter.com/Calculators/Heat-Sink-Temperature-Calculator.phtml> For example, With 12V source into a 3.3V LP2985 and a 30mA load, we are dissipating (12V-3.3V) * 0.03A = 0.261W. With a θJA of 206 °C/W, a TJ of 150°C, and 261mW we can safely use the chip without a heat sink up to 75°C (=147.1°C Junction Temperature).
U6 = microbuilder:ACCEL_ADXL377: ADXL377 +/-200g 3-Axis Analog Accelerometer VCC: 1.8-3.6V
U10 = TSM4ND50:TSM4ND50: MOSFET,N CH,500V,3A,TO252 Transistor Polarity: N Channel Continuous Drain Current Id: 3A Drain Source Voltage Vds: 500V On Resistance Rds(on): 2.3ohm Rds(on) Test Voltage Vgs: 10V Power Dissipation Pd: 45W Operating Temperature Range: -55°C to +150°C Transistor Case Style: TO-252 No. of Pins: 3 SVHC: No SVHC (18-Jun-2012) Power Dissipation Pd: 45W Voltage Vgs Max: 30V
U$1 = microbuilder:U.FL: U.FL Antenna Connector
U$6 = SparkFun:RESONATOR: Resonator Small SMD resonator. This is the itty bitty 10/20MHz resonators with built in caps. CSTCE10M0G55 and CSTCE20M0V53. Footprint has been reviewed closely but hasn't been tested yet.
U$61 = adafruit:XBEE
X2 = adafruit:MICROSD: Micro-SD / Transflash card holder with SPI pinout For the 3M # 2908-05WB-MG and/or 4UCON #19656 push-push type

## Net classes
1 16mil: width 0.254 mm, drill 0.254 mm, clearance 0.127 mm
2 24mil: width 0.254 mm, drill 0.254 mm, clearance 0.127 mm
3 32mil: width 0.254 mm, drill 0.254 mm, clearance 0.127 mm

## Board
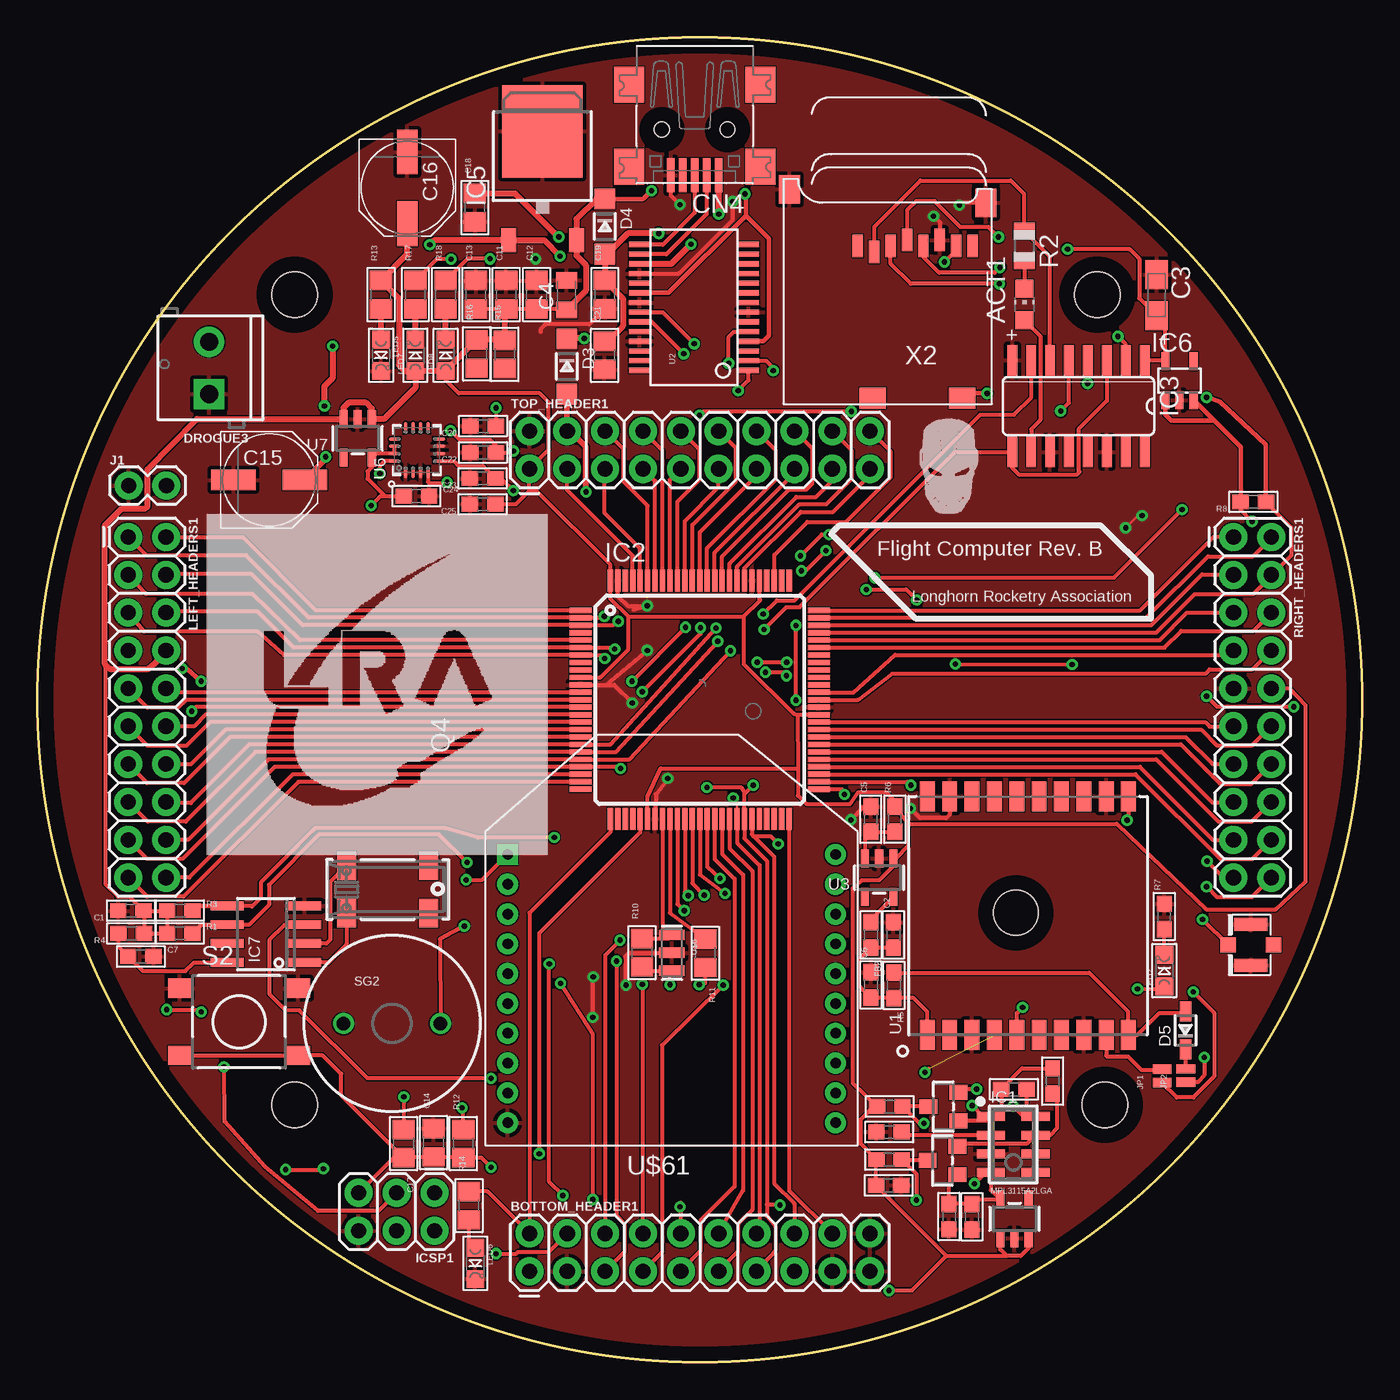
[diagram p2: board, top side]
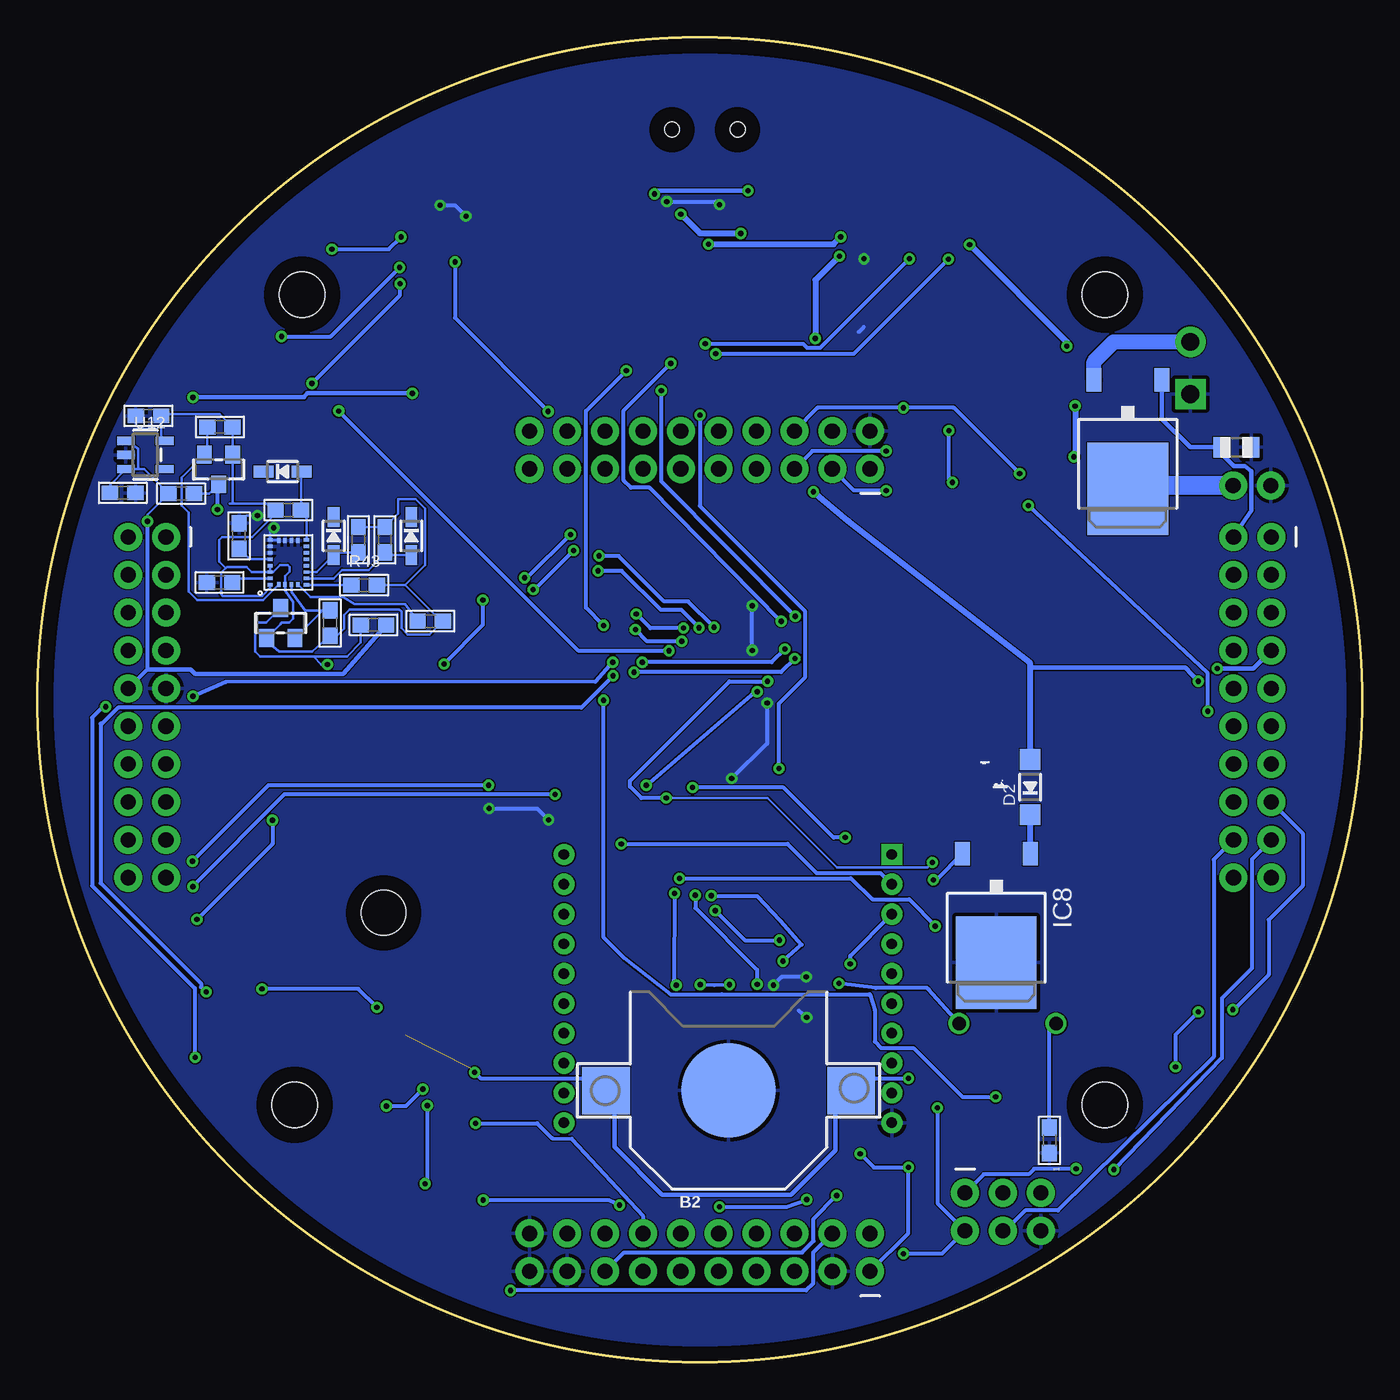
[diagram p3: board, bottom side, seen from below]

Size 88.9 x 88.9 mm. Coordinates in mm from the lower left corner, seen from the top.
Outline: circle at 44.45,44.45 radius 44.45
Copper layers (1*16): Top 0.035mm / dielectric 1.5mm / Bottom 0.035mm
Design rules "default *": minimum track width 6mil, minimum drill 0.35mm, track to track 3.5mil, track to pad 3.5mil, pad to pad 3.5mil, via to via 3.5mil, smd to smd 3.5mil, copper to edge 40mil, drill to drill 6mil, minimum pad ring 10mil, minimum via ring 8mil, stop-mask expansion 4mil, vias tented up to drill 0mil, thermal gap 10mil
Holes 3.05 mm at 17.27,71.63 71.12,71.63 71.63,17.27 17.27,17.27

### Footprints (pad centres in the part's own frame; a part is rotated, then mirrored left to right if it is on the bottom)
0603 = smd 1.1 x 1: 1 -0.85,0; 2 0.85,0
CHIP-LED0805 = smd 1.2 x 1.2: A 0,-1.05; C 0,1.05
CR1220 = smd 3.2 x 3.2: +$1 -8.225,0; +$2 8.225,0 | smd 6.35 x 6.35: - 0,0
2X10 = drill 1.016 pad 1.88: 1 0,0; 2 0,2.54; 3 2.54,0; 4 2.54,2.54; 5 5.08,0; 6 5.08,2.54; 7 7.62,0; 8 7.62,2.54; 9 10.16,0; 10 10.16,2.54; 11 12.7,0; 12 12.7,2.54; 13 15.24,0; 14 15.24,2.54; 15 17.78,0; 16 17.78,2.54; 17 20.32,0; 18 20.32,2.54; 19 22.86,0; 20 22.86,2.54
A/3216-18R = smd 1.95 x 1.5: + 1.375,0; - -1.375,0
C0805K = smd 1.1 x 1.4: 1 -1,0; 2 1,0
0805 = smd 1.3 x 1.5: 1 -0.95,0; 2 0.95,0
PANASONIC_D = smd 3 x 1.4: + 2.4,0; - -2.4,0
USB-MINIB = smd 0.5 x 2.308: D+ 0,4.064; D- -0.8,4.064; GND 1.6,4.064; ID 0.8,4.064; VBUS -1.6,4.064 | smd 2 x 2.4: GND1 -4.4,-2; GND2 -4.4,3.5; GND3 4.4,3.5; GND4 4.4,-2 | hole 1: -2.2,1; 2.2,1
SOD-123 = smd 1.4 x 1.4: A 1.85,0; C -1.85,0
SOD-323 = smd 1.35 x 0.8: A 1.27,0; C -1.27,0
SCREWTERMINAL-3.5MM-2 = drill 1.2 pad 2.032 square: 1 0,0 | drill 1.2 pad 2.032: 2 3.5,0
LGA8 = smd 1.9 x 0.6: P$1 -1.5,1.875; P$2 -1.5,0.625; P$3 -1.5,-0.625; P$4 -1.5,-1.875; P$5 1.5,-1.875; P$6 1.5,-0.625; P$7 1.5,0.625; P$8 1.5,1.875
TQFP100 = smd 1.5 x 0.35: 1 -8,6; 2 -8,5.5; 3 -8,5; 4 -8,4.5; 5 -8,4; 6 -8,3.5; 7 -8,3; 8 -8,2.5; 9 -8,2; 10 -8,1.5; 11 -8,1; 12 -8,0.5; 13 -8,0; 14 -8,-0.5; 15 -8,-1; 16 -8,-1.5; 17 -8,-2; 18 -8,-2.5; 19 -8,-3; 20 -8,-3.5; 21 -8,-4; 22 -8,-4.5; 23 -8,-5; 24 -8,-5.5; 25 -8,-6; 51 8,-6; 52 8,-5.5; 53 8,-5; 54 8,-4.5; 55 8,-4; 56 8,-3.5; 57 8,-3; 58 8,-2.5; 59 8,-2; 60 8,-1.5; 61 8,-1; 62 8,-0.5; 63 8,0; 64 8,0.5; 65 8,1; 66 8,1.5; 67 8,2; 68 8,2.5; 69 8,3; 70 8,3.5; 71 8,4; 72 8,4.5; 73 8,5; 74 8,5.5; 75 8,6 | smd 0.35 x 1.5: 26 -6,-8; 27 -5.5,-8; 28 -5,-8; 29 -4.5,-8; 30 -4,-8; 31 -3.5,-8; 32 -3,-8; 33 -2.5,-8; 34 -2,-8; 35 -1.5,-8; 36 -1,-8; 37 -0.5,-8; 38 0,-8; 39 0.5,-8; 40 1,-8; 41 1.5,-8; 42 2,-8; 43 2.5,-8; 44 3,-8; 45 3.5,-8; 46 4,-8; 47 4.5,-8; 48 5,-8; 49 5.5,-8; 50 6,-8; 76 6,8; 77 5.5,8; 78 5,8; 79 4.5,8; 80 4,8; 81 3.5,8; 82 3,8; 83 2.5,8; 84 2,8; 85 1.5,8; 86 1,8; 87 0.5,8; 88 0,8; 89 -0.5,8; 90 -1,8; 91 -1.5,8; 92 -2,8; 93 -2.5,8; 94 -3,8; 95 -3.5,8; 96 -4,8; 97 -4.5,8; 98 -5,8; 99 -5.5,8; 100 -6,8
SO16 = smd 0.66 x 2.032: 1 -4.445,-3.073; 2 -3.175,-3.073; 3 -1.905,-3.073; 4 -0.635,-3.073; 5 0.635,-3.073; 6 1.905,-3.073; 7 3.175,-3.073; 8 4.445,-3.073; 9 4.445,3.073; 10 3.175,3.073; 11 1.905,3.073; 12 0.635,3.073; 13 -0.635,3.073; 14 -1.905,3.073; 15 -3.175,3.073; 16 -4.445,3.073
TO252 = smd 1 x 1.6: 1 -2.28,-4.8; 2 2.28,-4.8 | smd 5.4 x 6.2: 3 0,2.5
SOT23-5L = smd 0.55 x 1.2: 1 -0.95,-1.3; 2 0,-1.3; 3 0.95,-1.3; 4 0.95,1.3; 5 -0.95,1.3
SOIC8_150MIL = smd 0.6 x 2.2: 1 -1.905,-2.6; 2 -0.635,-2.6; 3 0.635,-2.6; 4 1.905,-2.6; 5 1.905,2.6; 6 0.635,2.6; 7 -0.635,2.6; 8 -1.905,2.6
LGA24_3.5X3.1MM = smd 0.23 x 0.35: 1 -1.505,1.22; 6 -1.505,-1.22; 7 -1.075,-1.22; 8 -0.645,-1.22; 9 -0.215,-1.22; 10 0.215,-1.22; 11 0.645,-1.22; 12 1.075,-1.22; 13 1.505,-1.22; 18 1.505,1.22; 19 1.075,1.22; 20 0.645,1.22; 21 0.215,1.22; 22 -0.215,1.22; 23 -0.645,1.22; 24 -1.075,1.22 | smd 0.35 x 0.23: 2 -1.475,0.645; 3 -1.475,0.215; 4 -1.475,-0.215; 5 -1.475,-0.645; 14 1.475,-0.645; 15 1.475,-0.215; 16 1.475,0.215; 17 1.475,0.645
2X3 = drill 1.016 pad 1.88: 1 0,0; 2 0,2.54; 3 2.54,0; 4 2.54,2.54; 5 5.08,0; 6 5.08,2.54
1X02 = drill 1.016 pad 1.88: 1 0,0; 2 2.54,0
SJ_2S-NO-NS = smd 0.635 x 1.27: 1 -0.45,0; 2 0.45,0
CHIPLED_0805 = smd 1.2 x 1.2: A 0,-1.05; C 0,1.05
SOT23-WIDE = smd 1 x 1.2: 1 -0.95,-1; 2 0.95,-1; 3 0,1
CRYSTAL_8X3.8 = smd 1.3 x 1.9: P$1 -2.75,-1.6; P$2 2.75,-1.6; P$3 2.75,1.6; P$4 -2.75,1.6
R0805 = smd 1.1 x 1.4: 1 -1,0; 2 1,0
DTSM-6 = smd 1.55 x 1.3: 1 -3.975,2.25; 2 3.975,2.25; 3 -3.975,-2.25; 4 3.975,-2.25
BUZZER-12MM = drill 0.9: + 3.25,0; - -3.25,0
FGPMMOPA6H = smd 2 x 1: P$1 -8,6.75; P$2 -8,5.25; P$3 -8,3.75; P$4 -8,2.25; P$5 -8,0.75; P$6 -8,-0.75; P$7 -8,-2.25; P$8 -8,-3.75; P$9 -8,-5.25; P$10 -8,-6.75; P$11 8,-6.75; P$12 8,-5.25; P$13 8,-3.75; P$14 8,-2.25; P$15 8,-0.75; P$16 8,0.75; P$17 8,2.25; P$18 8,3.75; P$19 8,5.25; P$20 8,6.75 | hole 3: 0.2,0.8
SSOP28DB = smd 0.348 x 1.397: 1 -4.225,-3.656; 2 -3.575,-3.656; 3 -2.925,-3.656; 4 -2.275,-3.656; 5 -1.625,-3.656; 6 -0.975,-3.656; 7 -0.325,-3.656; 8 0.325,-3.656; 9 0.975,-3.656; 10 1.625,-3.656; 11 2.275,-3.656; 12 2.925,-3.656; 13 3.575,-3.656; 14 4.225,-3.656; 15 4.225,3.656; 16 3.575,3.656; 17 2.925,3.656; 18 2.275,3.656; 19 1.625,3.656; 20 0.975,3.656; 21 0.325,3.656; 22 -0.325,3.656; 23 -0.975,3.656; 24 -1.625,3.656; 25 -2.275,3.656; 26 -2.925,3.656; 27 -3.575,3.656; 28 -4.225,3.656
SOT23-5 = smd 0.55 x 1.2: 1 -0.95,-1.3; 2 0,-1.3; 3 0.95,-1.3; 4 0.95,1.3; 5 -0.95,1.3
LFCSP16_LQ = smd 0.8 x 0.25: 1 -1.5,0.75; 2 -1.5,0.25; 3 -1.5,-0.25; 4 -1.5,-0.75; 9 1.5,-0.75; 10 1.5,-0.25; 11 1.5,0.25; 12 1.5,0.75 | smd 0.25 x 0.8: 5 -0.75,-1.5; 6 -0.25,-1.5; 7 0.25,-1.5; 8 0.75,-1.5; 13 0.75,1.5; 14 0.25,1.5; 15 -0.25,1.5; 16 -0.75,1.5
TO252' = smd 5.4 x 6.2: D 0,1.23 | smd 1 x 1.6: G -2.28,-6.07; S 2.28,-6.07
U.FL = smd 2.2 x 0.85: P$1 0,1.375; P$2 0,-1.375 | smd 1.05 x 1: P$3 1.525,0; P$4 -1.525,0
RESONATOR-SMD = smd 0.7 x 1.7: 1 -1.2,0; 2 0,0; 3 1.2,0
XBEE = drill 0.7 pad 1.422 square: 1 -11,5.5 | drill 0.7 pad 1.422: 2 -11,3.5; 3 -11,1.5; 4 -11,-0.5; 5 -11,-2.5; 6 -11,-4.5; 7 -11,-6.5; 8 -11,-8.5; 9 -11,-10.5; 10 -11,-12.5; 11 11,-12.5; 12 11,-10.5; 13 11,-8.5; 14 11,-6.5; 15 11,-4.5; 16 11,-2.5; 17 11,-0.5; 18 11,1.5; 19 11,3.5; 20 11,5.5
MICROSD = smd 0.7 x 1.5: 1 9,-10.64; 2 7.9,-10.24; 3 6.8,-10.64; 4 5.7,-11.04; 5 4.6,-10.64; 6 3.5,-11.04; 7 2.4,-10.64; 8 1.3,-10.64 | smd 1.8 x 1.4: CD1 2,-0.44; CD2 8,-0.44 | smd 1.4 x 1.9: MT1 0.4,-13.54; MT2 13.6,-14.44

### Placement (x,y rotation side)
1  20.98,14.89 270 bottom
ACT1  66.23,70.98 0 top
B2  42.51,18.23 0 bottom
BOTTOM_HEADER1  33.02,6.1 0 top
C1  6.28,30.3 180 top
C2  57.46,28.67 90 top
C3  75.1,71.6 270 top
C4  35.51,71.6 90 top
C5  55.92,36.43 90 top
C6  55.94,25.32 90 top
C7  6.95,27.22 0 top
C10  57.15,15.45 180 top
C11  31.47,71.63 90 top
C12  33.5,71.63 90 top
C13  29.43,71.63 90 top
C14  26.59,14.73 90 top
C15  15.56,59.2 0 top
C16  24.83,78.8 270 top
C17  24.58,14.67 270 top
C18  29.36,77.47 90 top
C19  38.08,71.63 90 top
C20  29.91,62.81 180 top
C21  38.06,67.55 90 top
C22  29.91,61.04 180 top
C23  29.88,59.3 180 top
C24  25.44,58.11 0 top
C25  29.88,57.57 180 top
C26  62.71,9.75 270 top
C27  57.13,11.87 0 top
C28  61.17,9.77 270 top
C31  83.16,58.33 0 bottom
C32  81.43,63.5 180 bottom
C33  76.67,52.32 180 bottom
C34  75.36,55.44 90 bottom
CN4  44.11,83.71 180 top
D2  22.28,38.59 90 bottom
D3  35.53,66.81 270 top
D4  38.08,76.2 270 top
D5  77.05,22.26 90 top
D9  69.01,55.44 270 bottom
D10  63.8,55.44 270 bottom
D11  72.44,59.76 0 bottom
DROGUE3  11.52,64.96 90 top
FB2  55.93,28.67 270 top
IC1  65.48,14.61 0 top
IC2  44.45,44.45 0 top
IC3  69.86,64.15 180 top
IC5  33.89,80.08 0 top
IC6  76.64,65.87 0 top
IC7  15.34,28.72 90 top
IC8  24.56,29.32 180 bottom
IC9  72.06,53.66 90 bottom
ICSP1  26.65,11.37 180 top
J1  6.13,58.83 0 top
JP1  75.47,19.2 90 top
JP2  77.05,19.23 90 top
LED2  75.62,26.27 0 top
LED5  23.06,67.56 180 top
LED6  29.39,6.63 180 top
LED7  25.37,67.56 0 top
LED8  27.4,67.56 0 top
LEFT_HEADERS1  6.1,55.37 270 top
Q1  60.8,17.15 90 top
Q2  60.74,13.54 90 top
Q4  23.5,31.72 0 top
Q6  72.56,49.6 0 bottom
Q7  76.73,59.9 180 bottom
R1  9.57,28.77 0 top
R2  66.23,74.9 270 top
R3  9.57,30.3 0 top
R4  6.31,28.77 180 top
R5  57.47,25.29 270 top
R6  57.54,36.43 90 top
R7  75.61,29.9 90 top
R8  81.59,57.73 180 top
R9  68.12,18.87 270 top
R10  40.58,27.47 90 top
R11  44.83,27.44 270 top
R12  28.58,14.67 90 top
R13  23.06,71.63 90 top
R14  28.97,10.51 90 top
R15  31.36,67.62 90 top
R16  29.47,67.65 90 top
R17  25.37,71.63 90 top
R18  27.4,71.63 90 top
R19  57.16,13.6 0 top
R20  57.2,17.16 180 top
R21  65.53,18.32 180 top
R33  8.45,61.39 180 bottom
R35  76.64,62.76 0 bottom
R36  69.26,49.6 270 bottom
R37  66.34,49.47 0 bottom
R38  79.24,58.29 180 bottom
R39  72.06,57.18 180 bottom
R40  65.58,55.19 270 bottom
R41  67.36,55.19 270 bottom
R42  62.53,49.73 180 bottom
R43  66.98,52.14 180 bottom
RIGHT_HEADERS1  80.26,55.37 270 top
S2  13.54,22.84 0 top
SG2  23.8,22.73 0 top
TOP_HEADER1  33.02,59.94 0 top
U1  66.47,29.96 90 top
U2  44.07,70.77 90 top
U3  56.49,32.51 180 top
U4  65.57,9.62 0 top
U6  25.47,61.2 90 top
U7  21.5,61.99 180 top
U10  FDD8447L-F085CT-ND  [TO252']  15.73,59.84 180 bottom
U12  81.65,60.88 270 bottom
U$1  81.43,28 180 top
U$6  42.58,27.47 270 top
U$61  42.56,28.57 0 top
X2  64.06,64.25 180 top

### Tracks (layer width: path | path; a pad name or v marks a point on that pad's centre or on a via)
3.3V  (via drill 0.35)
  Top 0.406: U2.17 42.55,73.7 v43.86,75.01 | v34.99,75.5 32.07,78.42 C18.2
  Bottom 0.406: v43.86,75.01 35.48,75.01 v34.99,75.5
3V3_BATT  (via drill 0.35)
  Top 0.254: v30.45,19.05 22.16,19.05 17.59,23.62 16.67,23.62 15.61,24.69 15.61,28.38 16.59,29.36 IC7.3
  Bottom 0.254: 33.46,19.05 v30.45,19.05
3V3_SD  (via drill 0.35)
  Top 0.254: IC6.5 75.69,67.33 75.58,67.22 | v69.13,74.68 73.3,74.68 73.94,74.04 73.94,71.38 C3.+ 75.69,69.64 IC6.5 | v64.5,75.5 63.83,76.17 61.94,76.17 60.2,77.91 58.98,77.91 58.36,77.29 X2.4 | IC3.1 75.63,67.22 IC6.5
  Bottom 0.254: v69.13,74.68 65.32,74.68 v64.5,75.5
5.0V  (via drill 0.35)
  Top 0.254: C25.1 32.12,57.57 33.01,58.46 | 33.01,58.46 TOP_HEADER1.1 34.32,61.24 34.32,64.4 33.71,65.01 28.29,65.01 27.4,65.9 LED8.A | 4.57,46.79 4.57,32.09 5.42,31.24 6.18,31.24 C1.1 | C1.1 7.16,30.27 R4.1 | R3.1 | R3.1 R1.1 R4.1 | R4.1 | C1.1 R3.1 | R12.2 28.58,16.99 v28.5,17.07 | IC2.10 37.78,45.95 39.65,47.82 39.65,50.02 | 39.65,50.02 38.45,51.22 IC2.100 38.45,53.51 33.5,58.46 33.01,58.46 | 39.65,50.02 47.4,50.02 | 47.4,50.02 48.52,51.15 48.45,51.22 IC2.80 | 47.4,50.02 47.4,46.85 50.78,43.49 51.01,43.45 | 51.01,43.45 IC2.61 | 51.01,43.45 51.04,39.85 | 58.43,36.12 R6.2 57.54,37.65 56.94,38.25 55.11,38.25 54.56,37.46 51.6,37.46 51.04,38.02 51.04,39.85 | 58.43,36.12 58.43,34.62 57.62,33.81 U3.1 57.44,33.3 56.48,32.34 55.32,32.34 54.71,31.79 54.71,18.74 R20.2 56.12,17.16 55.23,16.28 55.23,14.68 R19.1 56.28,13.56 C27.1 61.01,7.13 | U4.3 66.52,7.66 65.99,7.13 65.04,7.13 | U4.1 64.62,7.56 65.04,7.13 | 61.01,7.13 65.04,7.13 | IC2.31 40.95,37.96 41.83,39.85 51.04,39.85 | v81.5,56.42 80.75,57.18 R8.2 | 58.43,36.12 72.42,36.12 78.42,30.39 83.09,30.39 85.1,32.25 85.1,44.07 84.05,45.21 RIGHT_HEADERS1.10 | v30.79,7.29 32.13,7.29 32.25,7.41 34.33,7.41 BOTTOM_HEADER1.4 | v57.15,4.82 58.7,4.82 61.01,7.13 | C13.1 31.26,70.68 31.36,70.58 | C11.1 C12.1 35.43,70.68 C4.1
  Top 0.305: U2.20 42.37,71.75 47.55,76.93 | 47.55,76.93 47.55,78.33 v47.49,78.39 | v41.21,78.61 40.65,78.05 D4.C | U2.4 48.72,68.5 49.1,68.89 49.1,75.38 47.55,76.93 | IC6.3 78.97,63.19 | 78.97,63.19 80.75,61.41 R8.2 | IC6.1 75.69,63.58 76.08,63.19 78.97,63.19
  Top 0.406: D4.C 37.51,78.05 36.18,76.72 IC5.2 36.17,74.26 36.82,73.61 36.82,71.91 C4.1 | C11.1 31.36,70.58 R15.2 31.33,68.6 R16.2 27.4,66.53 LED8.A LED7.A | LED7.A 24.65,66.51 24.26,66.9 24.26,71.38 R13.2 24.83,74.34 C16.+ | LED7.A 25.37,65.39 23.27,63.29 U7.1 22.45,63.99 22.07,64.37 20.88,64.37 20.55,64.04 U7.3 10.71,63.29 7.41,59.92 7.41,57.42 7.19,57.27 5.67,57.27 4.54,56.14 4.54,46.85 4.57,46.79 4.94,46.48 7.41,46.48 8.64,47.56 LEFT_HEADERS1.8
  Bottom 0.152: C31.1 84.01,58.87 U12.3 82.14,59.93 | 82.14,59.93 81.73,59.93 R38.2 81.5,56.87 v81.5,56.42 | 82.14,59.93 82.14,61.29 U12.1
  Bottom 0.254: v28.5,17.07 28.5,10.68 ICSP1.2 28.19,7.29 v30.79,7.29 | RIGHT_HEADERS1.10 81.5,46.51 v81.5,56.42 | BOTTOM_HEADER1.4 36.85,7.35 36.85,5.27 37.31,4.82 v57.15,4.82
  Bottom 0.305: v47.49,78.39 47.27,78.61 v41.21,78.61 | R37.2 68.39,46.18 78.3,46.18 78.61,46.48 81.47,46.48 81.5,46.51
+3V3  (via drill 0.35)
  Top 0.254: R9.1 66.08,19.72 R21.2 64.68,17.18 IC1.P$1 | IC1.P$1 63.7,16.2 Q1.1 | Q2.1 61.17,12.02 C28.1 62.69,10.62 C26.1 63.03,10.92 U4.5 63.98,11.55 63.98,12.68 | IC1.P$4 63.98,12.68 | IC1.P$1 63.46,16.48 v62.73,17.22 | v62.88,11.98 63.58,12.68 63.98,12.68
  Bottom 0.254: v62.73,17.22 62.73,12.13 v62.88,11.98
ADC0  (via drill 0.35)
  Top 0.254: U6.5 27.97,60.45 28.29,60.14 29.9,60.14 C23.1 31.13,59.3 v31.94,58.49 | IC2.97 39.95,54.11 35.54,58.52 35.54,59.92 TOP_HEADER1.3
  Bottom 0.254: v31.94,58.49 34.11,58.49 TOP_HEADER1.3
ADC1  (via drill 0.35)
  Top 0.254: U6.4 26.22,59.06 26.3,58.98 27.43,58.98 v27.49,59.04 | v27.74,62.51 28.35,61.91 30.39,61.91 30.76,61.53 C22.1 31.84,61.04 v31.94,61.14 | IC2.96 40.45,54.59 38.07,56.97 38.07,59.91 TOP_HEADER1.5
  Bottom 0.254: v27.49,59.04 27.74,59.28 v27.74,62.51 | v31.94,61.14 36.9,61.14 TOP_HEADER1.5
ADC2  (via drill 0.35)
  Top 0.254: U6.16 23.3,60.45 22.98,60.14 v22.98,59.62 | v30.79,64.04 30.79,62.83 C20.1 | IC2.95 40.95,57.47 39.32,59.1 39.32,61.27 TOP_HEADER1.6
  Bottom 0.254: v22.98,59.62 27.4,64.04 v30.79,64.04 36.55,64.04 TOP_HEADER1.6
ADC3
  Top 0.254: IC2.94 41.45,59.13 TOP_HEADER1.7
ADC4
  Top 0.254: IC2.93 41.95,61.17 TOP_HEADER1.8
ADC5
  Top 0.254: IC2.92 42.45,59.21 TOP_HEADER1.9
ADC6
  Top 0.254: IC2.91 42.95,57.73 44.44,59.22 44.44,61.22 TOP_HEADER1.10
ADC7
  Top 0.254: IC2.90 43.45,56.43 45.72,58.7 TOP_HEADER1.11
ADC8
  Top 0.254: IC2.89 43.95,56.17 46.88,59.1 46.88,61.33 TOP_HEADER1.12
ADC9
  Top 0.254: IC2.88 44.45,55.7 48.26,59.51 TOP_HEADER1.13
ADC10
  Top 0.254: IC2.87 44.95,54.61 49.56,59.22 49.56,61.18 TOP_HEADER1.14
ADC11
  Top 0.254: IC2.86 45.45,54.32 50.8,59.67 TOP_HEADER1.15
ADC12
  Top 0.254: IC2.85 45.95,54.06 50.44,58.55 51.6,58.55 52,58.95 52,61.28 TOP_HEADER1.16
ADC13
  Top 0.254: IC2.84 46.45,53.58 50.93,58.06 52.24,58.06 53.34,59.16 TOP_HEADER1.17
ADC14
  Top 0.254: IC2.83 46.95,53.38 51.15,57.58 52.94,57.58 54.65,59.28 54.65,61.17 TOP_HEADER1.18
ADC15
  Top 0.254: IC2.82 47.45,53.27 51.24,57.06 53.4,57.06 55.88,59.54 TOP_HEADER1.19
BATT_IN  (via drill 0.35)
  Top 0.305: v11,45.69 10.03,46.54 v9.72,46.54
  Top 0.406: TOP_HEADER1.4 35.53,62.51 35.53,62.7 | 35.53,62.7 D3.A | v36.82,58.4 36.82,61.4 35.53,62.7
  Bottom 0.305: 22.28,46.6 11.86,46.6 v11,45.69 | v9.72,46.54 7.3,46.54 LEFT_HEADERS1.7
  Bottom 0.406: D2.A 22.28,46.6 22.28,46.91 34.5,56.45 v36.82,58.4
C1
  Bottom 0.152: IC9.24 75.56,52.59 C33.1
CAP1
  Top 0.254: IC1.P$2 58.22,15.23 C10.1
CAP3
  Bottom 0.152: IC9.21 74.64,53.88 C34.1
CS_A/G
  Bottom 0.152: D10.A 65.41,54.17 65.53,54.29 | 65.53,54.29 R40.2 | IC9.7 69.03,52.59 68.46,53.16 66.66,53.16 65.53,54.29
CS_M
  Bottom 0.152: R41.2 68.84,54.34 D9.A 70.16,53.02 IC9.8
D0_RX0  (via drill 0.35)
  Top 0.254: LEFT_HEADERS1.1 7.34,54.13 14.02,54.13 18.2,49.95 IC2.2 37.88,49.95 v38.04,50.05 | v47.03,65.2 47.73,65.9 U2.1
  Bottom 0.254: v38.04,50.05 47.03,59.1 v47.03,65.2
D1_TX0  (via drill 0.35)
  Top 0.254: LEFT_HEADERS1.4 8.69,52.88 14.39,52.88 17.82,49.45 IC2.3 38.6,49.45 v38.98,49.71 | v46.39,67.03 46.39,68.79 46.75,69.15 U2.5
  Bottom 0.254: v38.98,49.71 47.82,58.67 49.07,58.67 49.56,59.16 49.56,63.86 v46.39,67.03
D2  (via drill 0.35)
  Top 0.254: LEFT_HEADERS1.6 8.7,50.35 14.78,50.35 17.19,47.95 IC2.6 38.64,47.95 v38.74,47.85 | v48.31,46.97 v50.29,46.97 | v78.3,20.45 78.3,19.23 77.85,18.78 JP2.1 | v78.46,44.68 79.16,43.98 v84.31,43.98
  Bottom 0.254: v38.74,47.85 39.62,46.97 v48.31,46.97 | v50.29,46.97 51.45,45.66 76.26,45.63 v78.46,44.68 | v78.3,20.45 78.33,20.48 78.33,25.09 85.22,31.97 85.22,43.25 84.49,43.98 v84.31,43.98
D3  (via drill 0.35)
  Top 0.254: IC2.7 37.1,47.45 | IC2.7 16.56,47.45 14.78,49.01 7.16,49.01 LEFT_HEADERS1.5 | IC2.7 37.83,47.45 v38.07,47.21 | v48.86,46.3 50.02,46.3 v50.26,46.05 | v77.57,24.84 78.97,23.44 78.97,19.17 77.57,17.77 76.45,17.77 JP1.1
  Bottom 0.254: v38.07,47.21 38.98,46.3 v48.86,46.3 | v50.26,46.05 52.4,43.92 83.45,43.92 84.55,42.85 84.64,42.85 84.64,32.16 77.91,25.42 77.91,25.18 v77.57,24.84
D4
  Top 0.254: IC2.1 18.71,50.45 13.84,55.32 8.69,55.32 LEFT_HEADERS1.2
  Bottom 0.305: U10.G 13.45,63.28 11.55,61.39 R33.2 9.45,60.96 8.63,60.14 7.89,60.14 7.44,59.8 7.44,57.15 LEFT_HEADERS1.2
D5
  Top 0.254: IC2.5 17.63,48.45 14.45,51.54 7.29,51.54 LEFT_HEADERS1.3
D6
  Top 0.254: IC2.15 11.29,43.45 10.52,42.67 LEFT_HEADERS1.12
D7
  Top 0.254: IC2.16 11.59,42.95 10,41.36 7.41,41.36 LEFT_HEADERS1.11
D8
  Top 0.254: IC2.17 12.64,42.45 10.3,40.11 8.66,40.11 LEFT_HEADERS1.14
D9
  Top 0.254: IC2.18 12.93,41.95 9.85,38.86 7.37,38.86 LEFT_HEADERS1.13
D10
  Top 0.254: IC2.23 17.14,39.45 10.2,32.51 LEFT_HEADERS1.20
D11
  Top 0.254: IC2.24 17.52,38.95 9.81,31.24 7.37,31.24 LEFT_HEADERS1.19
D13
  Top 0.254: R14.2 30.2,11.46 BOTTOM_HEADER1.2 33.02,30.16 38.45,35.59 IC2.26
D14_TX3
  Top 0.254: IC2.64 54.77,44.95 57.55,47.46 79.97,47.46 RIGHT_HEADERS1.7
D15_RX3
  Top 0.254: IC2.63 55.06,44.45 57.36,46.21 78.39,46.21 78.67,46.48 81.53,46.48 RIGHT_HEADERS1.8
D16_TX2
  Top 0.254: IC2.13 9.98,44.45 9.45,43.92 7.39,43.92 LEFT_HEADERS1.9
D17_RX2
  Top 0.254: IC2.12 8.9,44.95 LEFT_HEADERS1.10
D18_TX1  (via drill 0.35)
  Top 0.254: v35.27,11.19 34.35,12.1 v34.35,26.73
  Bottom 0.254: BOTTOM_HEADER1.15 49.52,7.38 37.58,7.38 36.82,8.14 36.82,9.63 v35.27,11.19 | v34.35,26.73 34.35,27.28 U$61.3
D19_RX1  (via drill 0.35)
  Top 0.254: IC2.45 47.95,35.41 48.05,35.31 | 48.05,35.31 49.44,33.92 49.44,12.01 50.8,10.65 BOTTOM_HEADER1.16 | 48.05,35.31 49.18,35.31 v49.71,34.78
  Bottom 0.254: v49.71,34.78 38.56,34.78 36.61,32.83 32.32,32.83 U$61.2
D20_SDA  (via drill 0.35)
  Top 0.254: Q2.3 58.07,13.54 R19.2 58.98,12.63 v58.98,10.88 | 48.95,10.58 48.95,33.65 47.45,35.15 IC2.44 47.45,38.12 | 48.95,10.58 48.95,9.81 49.53,9.11 49.53,7.49 BOTTOM_HEADER1.13 | v49.84,10.55 48.95,10.58 | 47.45,38.12 47.45,38.23 47.24,38.56 v44.93,38.56 | v34.69,35.2 29.57,35.2 27.37,35.84 18.65,35.84 15,32.19 15,31.15 14.42,30.57 14.36,30.63 IC7.5 | 47.45,38.12 v48.04,38.71 | v40.6,44.99 44.5,48.89 v44.5,49.29 | v51.27,53.1 51.54,53.1 v52.91,54.47 | v55.63,51.85 58.31,51.85 v59.01,51.15 | v61.6,46.85 v69.43,46.82
  Top 0.305: IC7.5 10.75,30.63 R3.2
  Bottom 0.152: Q6.3 73.54,49.62 74.28,49.62 74.28,47.7 73.94,47.37 70.35,47.37 | 70.35,47.37 68.12,47.37 67.19,48.3 R37.1 | v69.43,46.82 69.86,46.82 70.35,47.37
  Bottom 0.254: v58.98,10.88 50.57,10.88 v49.84,10.55 | v48.04,38.71 40.97,44.77 v40.6,44.99 | v44.5,49.29 45.69,50.48 47.06,50.48 49.68,53.1 v51.27,53.1 | v52.91,54.47 55.53,51.85 v55.63,51.85 | v59.01,51.15 59.01,49.47 v61.6,46.85 | v34.69,35.2 35.48,35.2 38.83,38.56 v44.93,38.56
D21_SCL  (via drill 0.35)
  Top 0.152: IC2.43 46.95,37.6 v46.7,37.86
  Top 0.254: Q1.3 R20.1 59.18,16.03 v59.5,16.03 | IC2.43 46.95,34.86 48.46,33.34 48.46,8.84 BOTTOM_HEADER1.14 | v28.83,33.53 26.94,35.42 18.93,35.42 15.54,32.03 15.54,30.69 14.21,29.36 IC7.6 | v39.9,45.69 43.49,49.29 v43.49,49.32 | v51.21,54.1 52.64,55.53 v53.13,55.53 | v56.2,52.64 72.24,52.64 v76.81,57.21
  Top 0.305: IC7.6 11.01,29.36 R1.2
  Bottom 0.152: v46.7,37.86 39.9,37.86 35.23,33.19 29.17,33.19 v28.83,33.53 | Q7.3 76.78,58.86 77.35,58.28 R38.1
  Bottom 0.254: v59.5,16.03 55.35,16.03 54.35,15.03 53.03,15 48.26,9.82 BOTTOM_HEADER1.14 | v46.7,37.86 48.37,37.86 49.13,38.62 49.13,39.01 42.46,45.69 v39.9,45.69 | v43.49,49.32 45.23,51.05 46.85,51.05 49.9,54.1 v51.21,54.1 | v53.13,55.53 56.02,52.64 v56.2,52.64 | v76.81,57.21 76.81,58.83 76.78,58.86
D22
  Top 0.254: IC2.78 49.45,54.17 51.66,56.39 54.25,56.39 57.27,59.41 57.27,61.09 TOP_HEADER1.20
D25
  Top 0.254: IC2.75 73.98,50.45 78.94,55.41 80.22,55.41 RIGHT_HEADERS1.1
D26
  Top 0.254: IC2.74 74.42,49.95 78.55,54.07 81.56,54.07 82.8,55.31 RIGHT_HEADERS1.2
D27
  Top 0.254: IC2.73 74.75,49.45 78.15,52.85 80.24,52.85 RIGHT_HEADERS1.3
D28  (via drill 0.35)
  Top 0.254: IC2.72 75.07,48.95 77.66,51.54 81.59,51.54 82.8,52.75 82.8,52.76 82.8,52.78 | 82.8,52.78 RIGHT_HEADERS1.4 | R8.1 84.16,56.02 84.16,54.13 82.8,52.78
  Top 0.305: R8.1 82.44,61.57 79.34,64.47 v78.46,64.74 | v63.73,65.01 62.38,65.01 X2.CD1
  Bottom 0.305: v78.46,64.74 70.99,64.74 70.81,65.01 v63.73,65.01
D29
  Top 0.254: IC2.71 75.3,48.45 77.14,50.29 RIGHT_HEADERS1.5
D30
  Top 0.254: IC2.60 78.36,42.95 78.67,42.64 80.23,42.64 RIGHT_HEADERS1.11
D31
  Top 0.254: IC2.59 78.1,42.45 79.16,41.39 81.53,41.39 81.53,41.4 RIGHT_HEADERS1.12
D32
  Top 0.254: IC2.58 77.04,41.95 78.86,40.13 RIGHT_HEADERS1.13
D33
  Top 0.254: IC2.57 76.72,41.45 79.37,38.8 81.47,38.8 RIGHT_HEADERS1.14
D34
  Top 0.254: IC2.56 75.45,40.95 78.85,37.55 80.22,37.55 RIGHT_HEADERS1.15
D35
  Top 0.254: IC2.55 75.07,40.45 79.25,36.27 81.48,36.27 RIGHT_HEADERS1.16
D36
  Top 0.254: IC2.54 73.98,39.95 78.88,35.05 RIGHT_HEADERS1.17
D37
  Top 0.254: IC2.53 73.69,39.45 79.37,33.77 81.53,33.77 81.53,33.78 RIGHT_HEADERS1.18
D38
  Top 0.254: IC2.50 50.45,11.53 BOTTOM_HEADER1.18
D39
  Top 0.254: IC2.70 75.63,47.95 76.75,49.07 81.58,49.07 RIGHT_HEADERS1.6
D40  (via drill 0.35)
  Top 0.254: IC2.52 58.37,38.95 v58.61,38.71 | v78.49,33.62 79.59,32.51 RIGHT_HEADERS1.19
  Bottom 0.254: v58.61,38.71 73.4,38.71 v78.49,33.62
D41  (via drill 0.35)
  Top 0.254: IC2.51 53.97,38.45 v54.16,38.1 | v78.46,31.91 79.16,31.21 81.5,31.21 RIGHT_HEADERS1.20
  Bottom 0.254: v54.16,38.1 72.33,38.1 v78.46,31.91
D42
  Top 0.254: IC2.42 46.45,34.47 47.98,32.95 47.98,10.24 47.03,9.3 47.03,7.44 45.72,6.13 BOTTOM_HEADER1.11
D43
  Top 0.254: IC2.41 45.95,34.12 47.37,32.7 47.37,11.53 BOTTOM_HEADER1.12
D44
  Top 0.254: IC2.40 45.45,33.77 46.79,32.43 46.79,11.8 44.5,9.51 44.5,7.47 43.18,6.15 BOTTOM_HEADER1.9
D45  (via drill 0.35)
  Top 0.254: IC2.39 44.95,33.26 v45.81,32.46 | v28.65,29.26 27.02,28.39 SG2.+ | BOTTOM_HEADER1.10 43.18,10.71 v43.13,10.42 | v37.28,10.91 37.28,22.01 v35.11,25.42
  Bottom 0.254: v43.13,10.42 38.62,10.42 v37.28,10.91 | SG2.+ 29.1,25.02 29.19,25.12 32.64,25.12 v35.11,25.42 | v45.81,32.46 34.32,32.46 32.86,31.06 30.39,31.06 v28.65,29.26
D46  (via drill 0.35)
  Top 0.254: IC2.38 44.45,32.73 v46.15,31.45 | v46.02,25.3 41.91,21.27 41.91,7.37 BOTTOM_HEADER1.7
  Bottom 0.254: v46.15,31.45 46.18,25.63 v46.02,25.3
D47  (via drill 0.35)
  Top 0.254: IC2.37 43.95,32.13 v44.74,31.33 | v40.6,25.36 40.6,8.68 BOTTOM_HEADER1.8
  Bottom 0.254: v44.74,31.33 44.74,30.48 40.6,26.34 v40.6,25.36
D48  (via drill 0.35)
  Top 0.254: IC2.36 43.45,31.53 v43.68,31.3 | v38.86,26.91 38.86,9.85 39.41,9.3 39.41,7.41 BOTTOM_HEADER1.5
  Bottom 0.254: v43.68,31.3 43.52,31.3 40.6,31.27 39.08,29.66 37.61,28.01 37.92,27.77 v38.86,26.91
D49  (via drill 0.35)
  Top 0.254: IC2.35 42.95,30.75 v43.4,30.3 | v39.11,28.32 38.1,27.31 BOTTOM_HEADER1.6
  Bottom 0.254: v43.4,30.3 41.42,28.32 v39.11,28.32
D50_MISO  (via drill 0.35)
  Top 0.254: LEFT_HEADERS1.17 7.38,33.77 9.75,33.77 15.93,39.95 IC2.22 39.02,39.95 v39.14,39.84 | X2.7 61.66,74.61 v60.87,73.82 | v54.62,63.8 44.68,63.8 v44.44,63.55 | v16.67,12.92 19.14,12.92 v19.2,12.98
  Bottom 0.254: LEFT_HEADERS1.17 7.41,33.74 7.41,26.43 9.42,24.41 9.42,20.42 v16.67,12.92 | ICSP1.1 25.4,12.62 22.37,12.62 22.01,12.98 v19.2,12.98 | v60.87,73.82 60.87,70.07 54.59,63.8 v54.62,63.8 | v44.44,63.55 44.44,57.45 37.4,50.41 37.4,45.93 39.17,44.17 39.17,39.87 v39.14,39.84
D51_MOSI  (via drill 0.35)
  Top 0.254: LEFT_HEADERS1.18 10.12,35.05 15.52,40.45 IC2.21 39.75,40.45 v46.51,47.73 | v68.67,63.83 69.22,64.38 IC3.5
  Bottom 0.254: LEFT_HEADERS1.18 9.97,33.72 9.97,20.48 20.42,10.18 22.62,10.18 23.97,8.83 ICSP1.4 | v46.51,47.73 52.58,47.73 v68.67,63.83
D52_SCK  (via drill 0.35)
  Top 0.254: LEFT_HEADERS1.15 7.42,36.27 9.97,36.27 14.65,40.95 IC2.20 38.85,40.95 v45.66,48.37 | ICSP1.3 22.89,10.15 18.84,10.15 15.3,13.11 12.56,16.15 v12.53,19.81 | v48.77,49.16 50.26,50.66 51.15,50.66 61.56,61.08 IC3.9 65.42,60.01 65.9,59.53 69.71,59.53 69.92,59.74 69.86,59.8 69.86,62.61 71.77,64.51 IC3.3 | v8.69,23.65 10.85,23.65 v11,23.5
  Bottom 0.254: LEFT_HEADERS1.15 3.99,35.49 3.99,31.97 6.28,29.69 6.28,26 8.63,23.65 v8.69,23.65 | v45.66,48.37 47.98,48.37 v48.77,49.16 | 11.06,23.44 v11,23.5 12.53,21.98 v12.53,19.81
D53_SS  (via drill 0.35)
  Top 0.254: LEFT_HEADERS1.16 8.71,37.52 10.3,37.52 14.23,41.45 IC2.19 38.46,41.45 v45.54,49.26 | v48.71,50.2 49.62,51.12 50.81,51.12 63.28,63.58 65.53,63.58 66.69,64.73 IC3.7
  Bottom 0.254: v45.54,49.26 47.76,49.26 v48.71,50.2
D+
  Top 0.254: CN4.D+ 44.11,77.12 41.97,74.98 41.95,75 U2.15
D-
  Top 0.254: CN4.D- 44.91,77.04 42.22,74.34 42.21,74.35 U2.16
DEN_3V
  Bottom 0.152: IC9.13 70.84,56.59 R39.1 71.21,59.72 D11.A
FIX  (via drill 0.35)
  Top 0.254: U1.P$5 65.72,23.41 v66.11,23.8 | v73.82,25.05 75.45,25.05 LED2.A
  Bottom 0.254: v66.11,23.8 67.36,25.05 v73.82,25.05
GND  (via drill 0.35)
  Top 0.152: v73.03,55.99 73.85,56.81 v74.13,56.81
  Top 0.254: U2.18 43.06,73.05 46.66,76.66 v46.66,77.88 | v43.13,77.66 42.51,78.28 CN4.GND | IC2.11 38.16,45.45 | 38.16,45.45 v40.94,47.76 | 40.02,50.48 v40.94,50.75 39.62,50.75 38.95,51.42 IC2.99 | U1.P$19 61.22,36.74 60.99,36.52 59.22,36.52 v58.58,37.16 | v54.59,36.39 55.48,37.28 C5.2 | X2.MT1 62.03,77.79 v61.87,77.63 | v60.14,76.9 60.56,76.48 X2.6 | C19.1 37.05,69.65 34.11,69.65 33.77,69.31 33.77,69.13 | 33.44,72.64 C12.2 | 38.16,45.45 38.7,45.45 v39.93,44.23 | v42.31,39.17 41.51,38.1 IC2.32 | 42.77,27.28 U$6.2 39.72,27.46 39.44,27.19 39.5,27.13 v39.5,25.3 | v37.28,23.13 37.28,25.82 v37.31,25.85
  Bottom 0.152: IC9.17 72.73,55.17 IC9.18 73.28,55.75 v73.03,55.99 | v74.13,56.81 74.83,56.81 C34.2
  Bottom 0.254: v46.66,77.88 43.34,77.88 v43.13,77.66 | v40.94,47.76 v40.94,50.75 | v58.58,37.16 55.35,37.16 v54.59,36.39 | 37.83,23.59 v37.28,23.13 | v61.87,77.63 60.87,77.63 v60.14,76.9 | 33.77,69.13 33.44,69.46 | v39.93,44.23 39.93,41.51 v42.31,39.17 | v37.31,25.85 38.95,25.85 v39.5,25.3
  other vias: 33.44,74.04
  pour Top: 44.45,0 arc90 88.9,44.45 arc90 44.45,88.9 arc90 0,44.45 arc90
  pour Bottom: 44.45,0 arc90 88.9,44.45 arc90 44.45,88.9 arc90 0,44.45 arc90
GPS_RX
  Top 0.254: JP2.2 D5.C
GPS_TX
  Top 0.254: U1.P$9 71.72,20.57 71.78,20.51 73.18,20.51 74.07,19.63 75.44,19.63 JP1.2
IGNITER_BATT
  Bottom 1.27: J1.2 15.52,58.83 U10.D
N$2
  Top 0.254: Q4.P$1 20.75,28.04 19.51,26.79 19.48,26.82 IC7.1
N$3
  Top 0.254: Q4.P$4 19.66,32.23 19.66,28.35 19.4,28.09 IC7.2
N$6
  Top 0.254: ACT1.A 67.3,68.86 67.3,63.22 66.69,62.6 IC3.10
N$7  (via drill 0.35)
  Top 0.254: IC3.2 73.03,68.3 v72.51,68.82 | v64.59,73.46 64.22,73.09 60.5,73.09 59.46,74.14 X2.5
  Bottom 0.254: v72.51,68.82 69.22,68.82 v64.59,73.46
N$8
  Top 0.254: X2.2 56.16,76.18 59.25,79.28 65.32,79.28 66.2,78.39 66.2,75.93 R2.1 67.95,74.18 IC3.6
N$9
  Top 0.254: R2.2 ACT1.C
N$10  (via drill 0.35)
  Top 0.254: IC3.4 70.5,65.71 v70.47,65.68 | v64.56,72.36 58.61,72.36 57.26,73.71 X2.3
  Bottom 0.254: v70.47,65.68 64.56,71.6 v64.56,72.36
N$11
  Top 0.254: R4.2 5.46,27.86 C7.1 7.08,26.24 9.94,26.24 10.52,26.82 IC7.8
N$12  (via drill 0.35)
  Top 0.254: U1.P$11 73.22,36.46 v73.12,36.36 | v78.18,29.72 U$1.P$3
  Bottom 0.254: v73.12,36.36 73.12,34.78 v78.18,29.72
N$13
  Top 0.254: R5.1 70.58,26.14 73.18,23.53 73.18,22 U1.P$10 73.81,21.96 75.29,23.44 76.95,23.44 D5.A
N$14
  Top 0.254: C2.1 FB2.2 55.11,27 55.11,25.3 C6.1 57.44,24.47 R5.2 58.8,24.45 59.72,23.52 U1.P$1
N$15  (via drill 0.35)
  Top 0.254: R10.1 40.83,26.27 42.43,26.27 | 42.43,26.27 U$6.3 | v44.41,25.33 44.83,25.44 R11.2 | v42.46,25.33 42.46,26.24 42.43,26.27
  Bottom 0.254: v42.46,25.33 43.46,25.3 v44.41,25.33
N$18
  Top 0.254: R6.1 C5.1 55.54,35.2 U3.3
N$19
  Top 0.254: LED2.C R7.1
N$22
  Bottom 0.406: IC8.1 D2.C
N$23
  Bottom 0.254: 1.1 20.98,22.5 SG2.-
N$36  (via drill 0.35)
  Top 0.254: 23.33,58.11 C24.1 | 23.33,58.11 22.16,59.28 22.16,59.77 22.45,60.06 U7.5 22.71,60.95 U6.15 U6.14 | IC2.14 10.63,43.95 v10.36,43.68 | v22.4,57.48 23.03,58.11 23.33,58.11
  Bottom 0.254: v10.36,43.68 10.36,46.24 v22.4,57.48
N$45
  Top 0.406: LED5.A R13.1
N$46
  Top 0.254: LED6.A 28.96,8.11 R14.1
N$47
  Top 0.406: LED8.C R18.1
N$48
  Top 0.406: LED7.C R17.1
N$51  (via drill 0.35)
  Top 0.254: U2.2 48.9,67.2 49.38,66.72 v49.38,66.54 | v24.6,17.8 24.58,17.78 C17.1 | v50.9,44.41 v50.9,49.44
  Bottom 0.254: v24.6,17.8 26.82,17.8 30.11,21.09 32.28,21.09 32.7,21.52 32.7,23.62 33.04,24.69 42.98,24.69 46.42,24.69 49.5,27.1 50.9,28.5 v50.9,44.41 | v50.9,49.44 52.09,50.63 52.09,63.83 v49.38,66.54
N$52  (via drill 0.35)
  Top 0.254: U2.22 41.96,70.45 v44.07,68.34 | v30.39,74.04 28.86,74.04 R18.2
  Bottom 0.254: v44.07,68.34 37.52,68.34 37.25,68.06 36.36,68.06 v30.39,74.04
N$53  (via drill 0.35)
  Top 0.254: U2.23 41.24,69.8 v43.37,67.67 | v27.77,74 26.8,74 R17.2
  Bottom 0.254: v43.37,67.67 34.11,67.67 v27.77,74
OUT
  Top 0.254: U3.5 55.93,29.71 FB2.1
RESET  (via drill 0.35)
  Top 0.254: ICSP1.5 23.92,13.72 C17.2 | C17.2 24.64,13.78 C14.1 28.52,13.78 | 28.52,13.78 R12.1 29.8,13.72 v30.45,13.08 | 29.01,13.78 28.52,13.78 | IC2.30 40.45,35.54 33.68,28.77 v33.68,13.99 | S2.3 17.28,20.59 S2.4 19.16,20.59 20.39,19.36 20.39,17.91 C17.2
  Bottom 0.254: BOTTOM_HEADER1.1 30.45,8.67 v30.45,13.08 32.77,13.08 v33.68,13.99
SCL_3.3V  (via drill 0.35)
  Top 0.254: R21.1 66.38,17.09 IC1.P$8 66.18,16.48 v65.47,17.19 | v63.03,18.32 62.01,18.32 Q1.2
  Bottom 0.254: v65.47,17.19 64.16,17.19 v63.03,18.32
SCL_3V
  Bottom 0.152: R35.1 77.49,61.09 Q7.2 79.22,59.37 79.22,57.48 78.73,57 78.73,51.69 78.18,51.15 73.74,51.15 IC9.2
SDA_3.3V
  Top 0.254: R9.2 68.43,17.71 68.43,15.7 67.97,15.23 IC1.P$7 66.44,14.69 61.94,14.69 Q2.2
SDA_3V
  Bottom 0.152: Q6.2 69.76,50.45 | 69.76,50.45 R36.1 | IC9.4 71.84,51.69 70.93,50.45 69.76,50.45
SDO_AG
  Bottom 0.152: IC9.5 70.55,51.33 68.37,51.33 67.61,50.87 64.22,50.87 R42.2
SDO_M
  Bottom 0.152: R43.2 70.82,52.14 IC9.6
SOURCE2
  Bottom 1.016: U10.S 18.01,67.12 16.67,68.46 DROGUE3.2
VBACKUP  (via drill 0.35)  (1 unrouted)
  Top 0.254: 64.19,21.93 U1.P$4 | 59.81,19.7 v59.56,19.45
  Bottom 0.254: v59.56,19.45 59.16,19.05 51.56,19.05 B2.+$1
  Bottom 0.305: B2.+$2 35.36,17.16 35.36,14.2 38.31,11.25 46.97,11.25 50.17,14.45 50.17,17.66 B2.+$1
VCC  (via drill 0.35)
  Top 0.254: v28.77,32.37 29.86,32.37 U$61.1
  Bottom 0.254: IC8.2 28.59,32.37 v28.77,32.37
VDD
  Bottom 0.152: R41.1 R40.1 64.68,56.94 64.68,57.91 63.52,57.91 62.88,57.27 62.88,53.49 64.23,52.14 | 64.23,52.14 R43.1 | 64.23,52.14 61.82,49.73 R42.1 62.58,48.83 64.04,48.83 64.47,49.26 64.47,50.35 64.62,50.51 67.94,50.51 68.31,50.14 68.31,49.23 68.78,48.75 R36.2 70.46,47.67 72.66,47.67 73.51,48.4 Q6.1 72.57,49.54 72.57,49.56 72.51,49.62 71.99,49.62 71.72,49.9 71.72,50.99 72.27,51.79 IC9.3 72.27,52.76 71.96,53.07 71.96,53.37 72.08,53.49 72.6,53.49 73.08,53.02 IC9.23 | IC9.22 IC9.23 | IC9.23 74.51,53.02 74.86,53.37 76.17,53.37 76.25,53.29 | 75.99,57.61 75.71,57.61 | 75.71,57.61 73.55,57.61 72.94,57 | 72.94,57 R39.2 | U12.5 80.58,62.06 C32.1 80.47,63.61 76.65,63.61 R35.2 75.78,62.75 Q7.1 75.78,57.68 75.71,57.61 | 76.25,53.29 76.57,52.97 76.57,51.54 76.44,51.42 73.82,51.42 73.28,51.97 IC9.1 | 76.25,53.29 76.69,53.74 76.69,55.17 76.5,55.35 74.49,55.35 72.94,56.91 72.94,57
VIN  (via drill 0.35)
  Top 0.406: v35.08,74.22 34.02,75.28 IC5.1 26.63,75.28 v26.34,74.98 | v36.7,68.7 35.57,68.7 D3.C | v19.81,68.18 19.81,66.02 19.26,65.47 v19.26,64.16 | v19.36,60.75 19.36,60.59 C15.+
  Bottom 0.406: v35.08,74.22 36.7,72.6 v36.7,68.7 | v26.34,74.98 19.81,68.46 v19.81,68.18 | v19.26,64.16 19.26,60.84 v19.36,60.75
VUSB  (via drill 0.35)
  Top 0.254: v45.71,77.03 v45.72,77.02 | 38.23,74.35 D4.A
  Top 0.406: CN4.VBUS v45.71,77.03 | v41.7,75.74 39.62,75.74 38.23,74.35 | D4.A C19.2 39.29,71.37 39.29,69.53 38.27,68.5 C21.2
  Bottom 0.406: v45.72,77.02 44.44,75.74 v41.7,75.74
XTAL1
  Top 0.254: IC2.34 42.45,30.16 R11.1
XTAL2
  Top 0.254: IC2.33 41.95,28.88 U$6.1 42.33,28.42 R10.2

### Text on the board
tPlace: Flight Computer Rev. B | Longhorn Rocketry Association
tOrigins: Main Board